# EAGLE design Main-v4.1 (EAGLE 9.1.0)
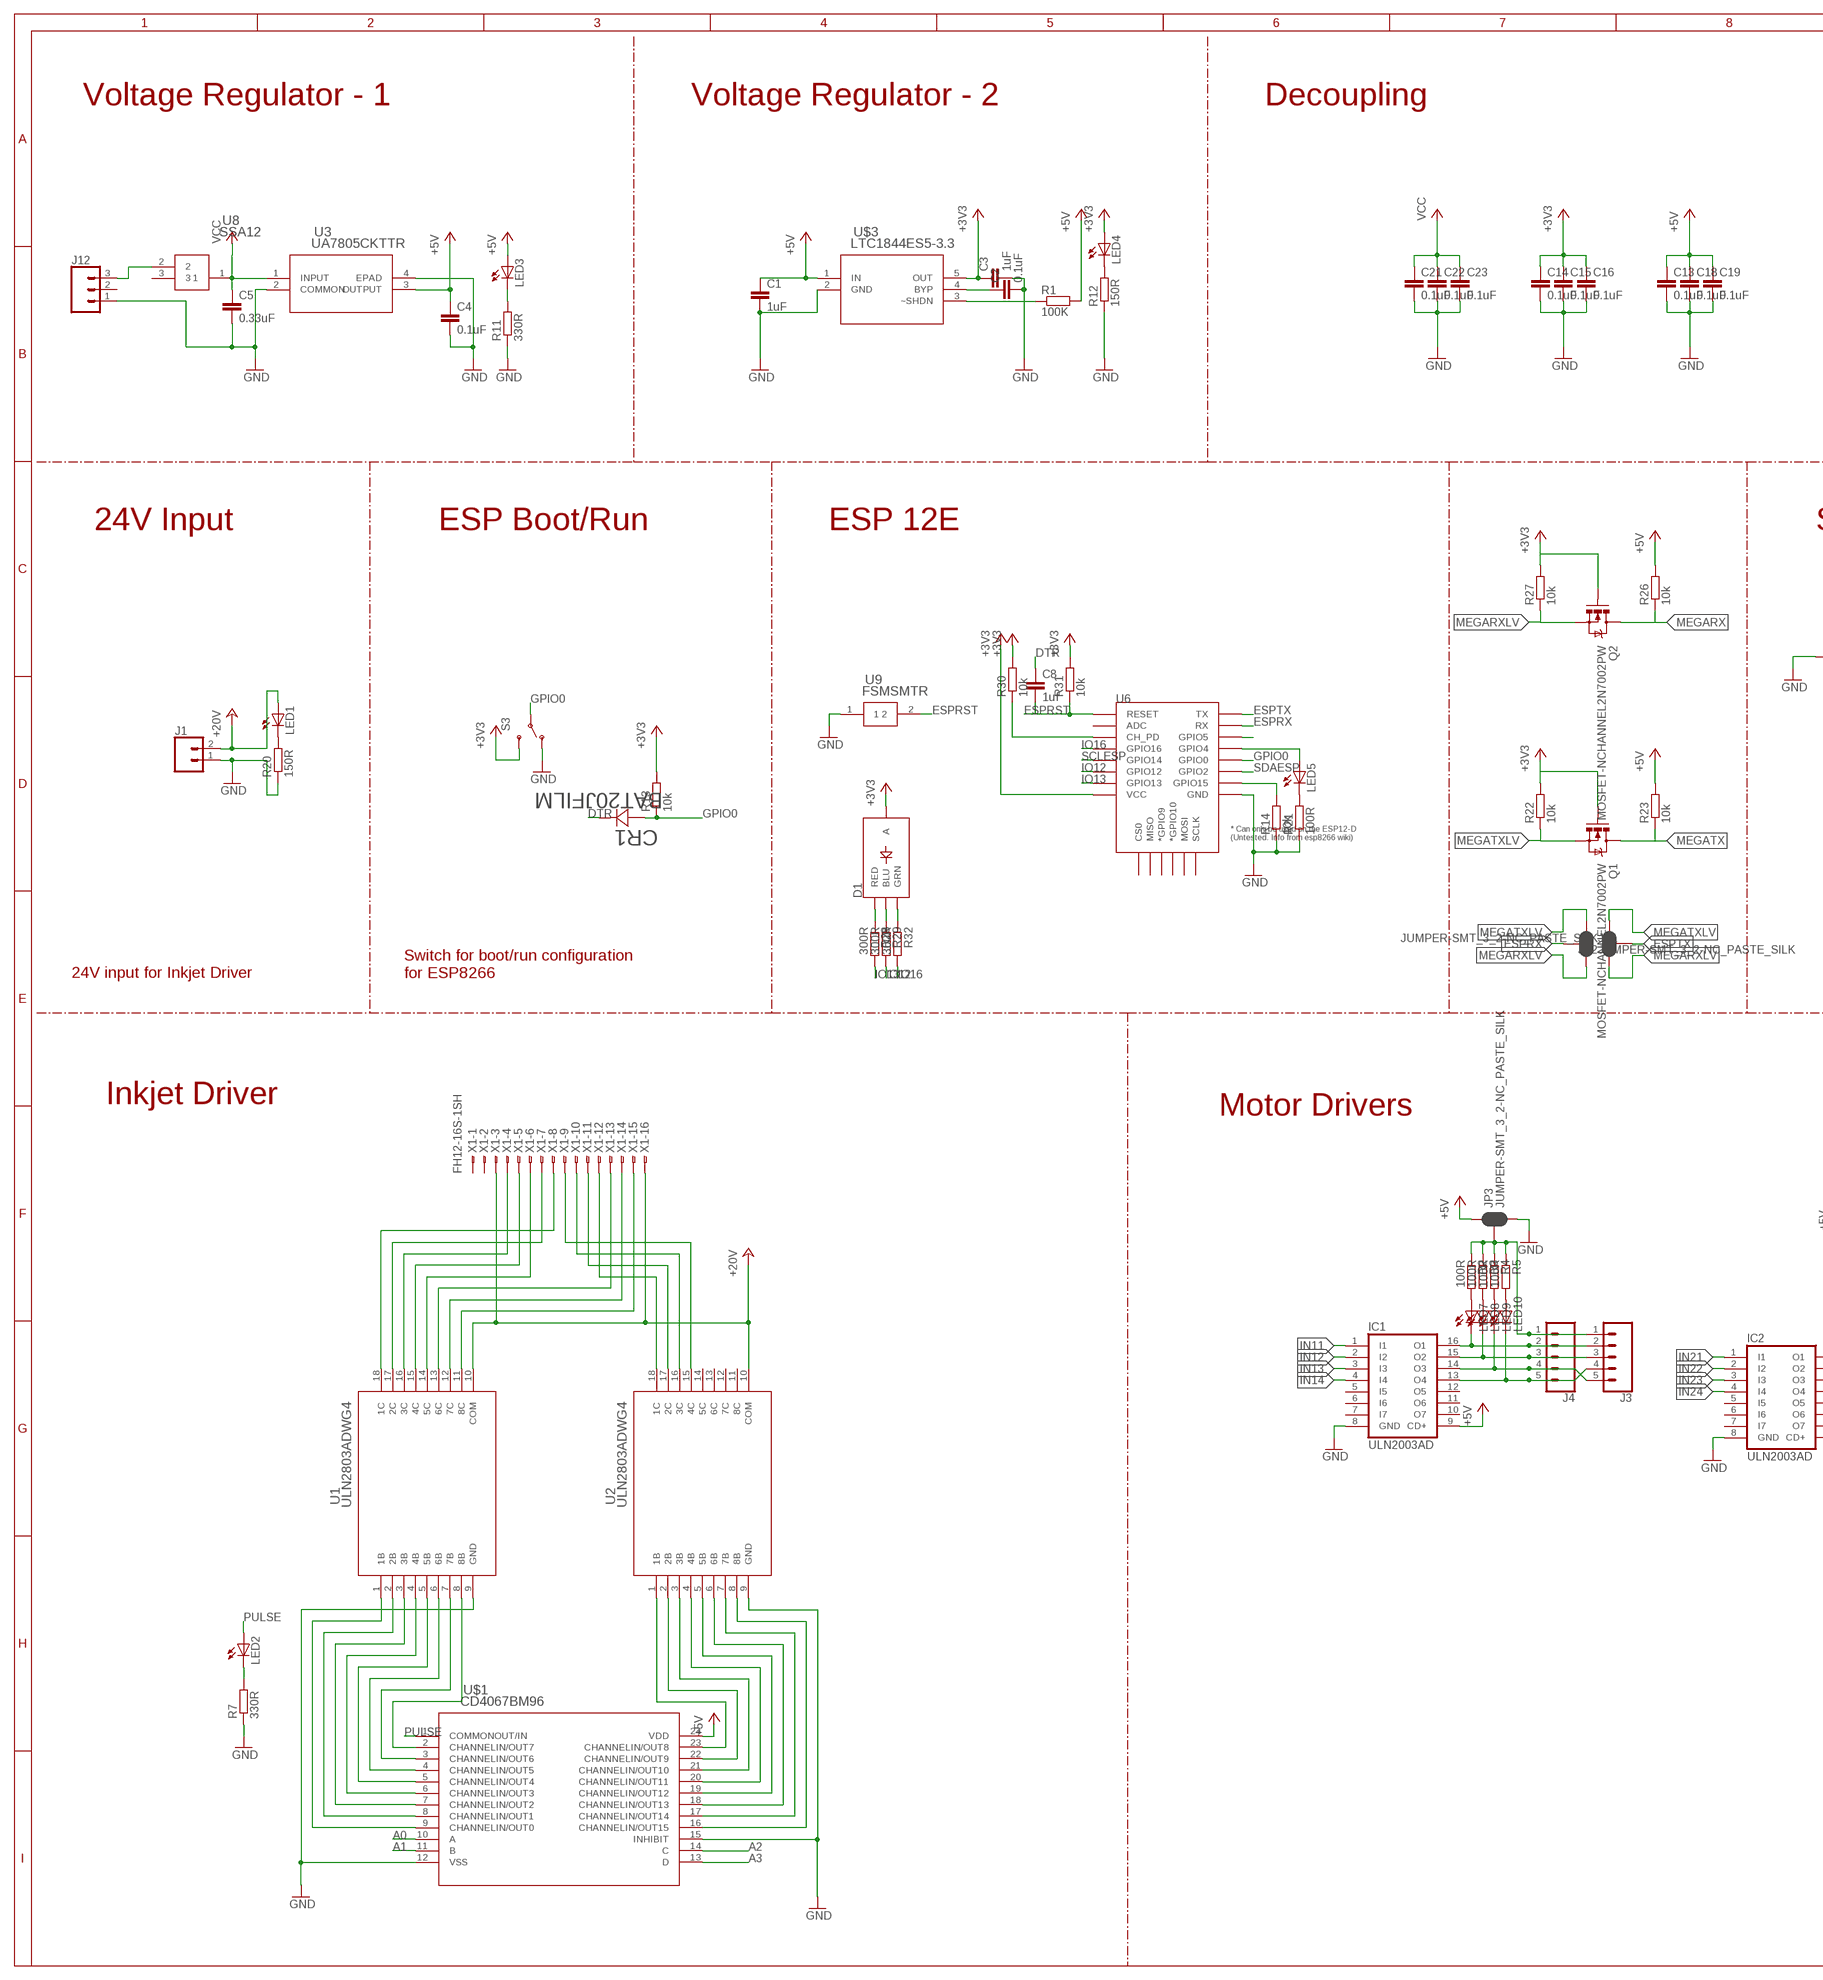
[diagram p0: schematic, sheet 1, part 1 of 3]
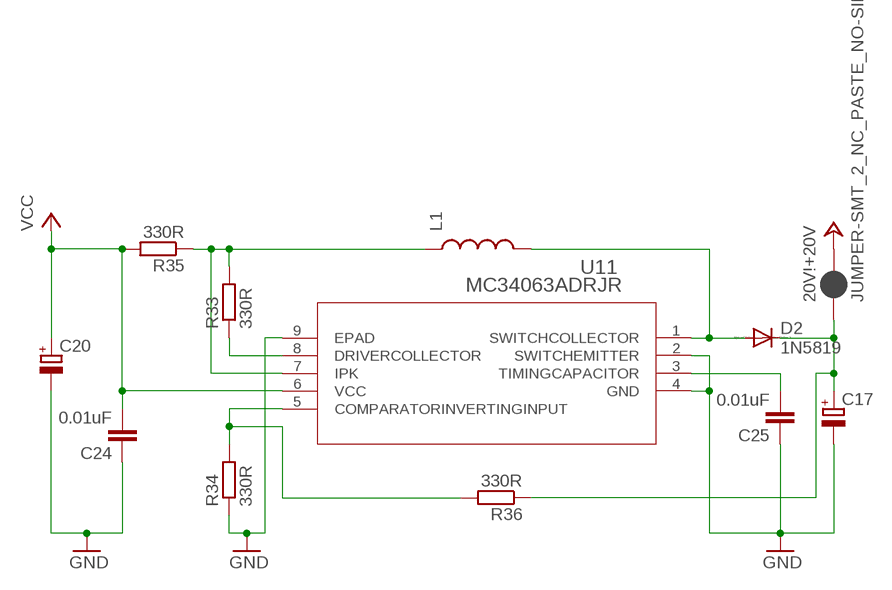
[diagram p1: schematic, sheet 1, part 2 of 3]
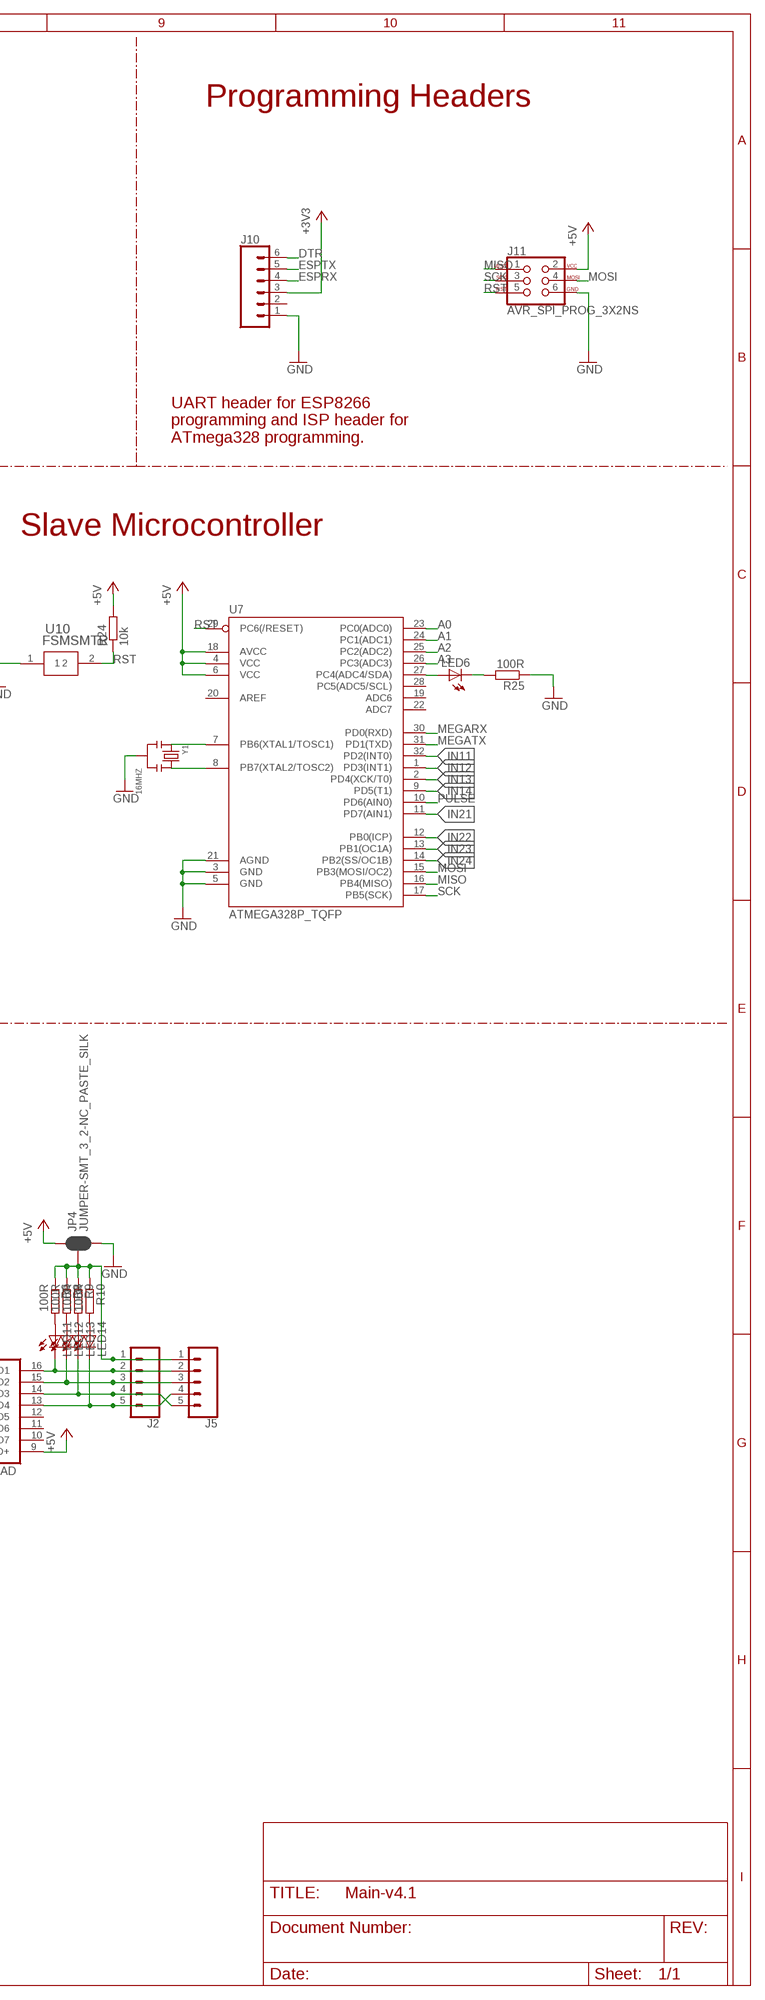
[diagram p2: schematic, sheet 1, part 3 of 3]

## Parts
20V!  JUMPER-SMT_2_NC_PASTE_NO-SILK  [SMT-JUMPER_2_NC_PASTE_NO-SILK]
C1  1uF  C-EUC0603  [C0603]
C2  0.1uF  C-EUC0603  [C0603]
C3  1uF  C-EUC0603  [C0603]
C4  0.1uF  C-EUC0603  [C0603]
C5  0.33uF  C-EUC0603  [C0603]
C8  1uf  C-EUC0603  [C0603]
C13  0.1uF  C-EUC0603  [C0603]
C14  0.1uF  C-EUC0603  [C0603]
C15  0.1uF  C-EUC0603  [C0603]
C16  0.1uF  C-EUC0603  [C0603]
C17  CPOL-EU153CLV-1010  [153CLV-1010]
C18  0.1uF  C-EUC0603  [C0603]
C19  0.1uF  C-EUC0603  [C0603]
C20  CPOL-EUSMCC  [SMC_C]
C21  0.1uF  C-EUC0603  [C0603]
C22  0.1uF  C-EUC0603  [C0603]
C23  0.1uF  C-EUC0603  [C0603]
C24  0.01uF  C-EUC0603K  [C0603K]
C25  0.01uF  C-EUC0603K  [C0603K]
CR1  BAT20JFILM  [SOD-323]
D1  LED-RGB-CASMD  [LED-TRICOLOR-SMD]
D2  1N5819  [SOD123]
IC1  ULN2003AD  [SO16]
IC2  ULN2003AD  [SO16]
J1  CONN_02  [1X02]
J2  CONN_05  [1X05]
J3  CONN_05  [1X05]
J4  CONN_05  [1X05]
J5  CONN_05  [1X05]
J10  CONN_06NO_SILK_NO_POP  [1X06_NO_SILK]
J11  AVR_SPI_PROG_3X2NS  [2X3-NS]
J12  CONN_03  [1X03]
JP1  JUMPER-SMT_3_2-NC_PASTE_SILK  [SMT-JUMPER_3_2-NC_PASTE_SILK]
JP2  JUMPER-SMT_3_2-NC_PASTE_SILK  [SMT-JUMPER_3_2-NC_PASTE_SILK]
JP3  JUMPER-SMT_3_2-NC_PASTE_SILK  [SMT-JUMPER_3_2-NC_PASTE_SILK]
JP4  JUMPER-SMT_3_2-NC_PASTE_SILK  [SMT-JUMPER_3_2-NC_PASTE_SILK]
L1  INDUCTORCR54  [CR54]
LED1  LEDSML0603  [SML0603]
LED2  LEDSML0603  [SML0603]
LED3  LEDSML0603  [SML0603]
LED4  LEDSML0603  [SML0603]
LED5  LEDSML0603  [SML0603]
LED6  LEDSML0603  [SML0603]
LED7  LEDSML0603  [SML0603]
LED8  LEDSML0603  [SML0603]
LED9  LEDSML0603  [SML0603]
LED10  LEDSML0603  [SML0603]
LED11  LEDSML0603  [SML0603]
LED12  LEDSML0603  [SML0603]
LED13  LEDSML0603  [SML0603]
LED14  LEDSML0603  [SML0603]
Q1  MOSFET-NCHANNEL2N7002PW  [SOT323]
Q2  MOSFET-NCHANNEL2N7002PW  [SOT323]
R1  100K  R-EU_R0603  [R0603]
R2  100R  R-EU_R0603  [R0603]
R3  100R  R-EU_R0603  [R0603]
R4  100R  R-EU_R0603  [R0603]
R5  100R  R-EU_R0603  [R0603]
R6  100R  R-EU_R0603  [R0603]
R7  330R  R-EU_R0603  [R0603]
R8  100R  R-EU_R0603  [R0603]
R9  100R  R-EU_R0603  [R0603]
R10  100R  R-EU_R0603  [R0603]
R11  330R  R-EU_R0603  [R0603]
R12  150R  R-EU_R0603  [R0603]
R13  10k  R-EU_R0603  [R0603]
R14  10k  R-EU_R0603  [R0603]
R20  150R  R-EU_R0603  [R0603]
R21  100R  R-EU_R0603  [R0603]
R22  10k  R-EU_R0603  [R0603]
R23  10k  R-EU_R0603  [R0603]
R24  10k  R-EU_R0603  [R0603]
R25  100R  R-EU_R0603  [R0603]
R26  10k  R-EU_R0603  [R0603]
R27  10k  R-EU_R0603  [R0603]
R28  300R  R-EU_R0603  [R0603]
R29  300R  R-EU_R0603  [R0603]
R30  10k  R-EU_R0603  [R0603]
R31  10k  R-EU_R0603  [R0603]
R32  300R  R-EU_R0603  [R0603]
R33  330R  R-EU_R0603  [R0603]
R34  330R  R-EU_R0603  [R0603]
R35  330R  R-EU_R0603  [R0603]
R36  330R  R-EU_R0603  [R0603]
S3  SWITCH-SPDT-SMD-A  [SWITCH-SPST-SMD-A]
U1  ULN2803ADWG4  [DW18]
U2  ULN2803ADWG4  [DW18]
U3  UA7805CKTTR  [KTT3_6P22X6P6]
U6  ESP12ESMD  [ESP12E-SMD]
U7  ATMEGA328P_TQFP  [TQFP32-08]
U8  SSA12  [SWSIP3-P98]
U9  FSMSMTR  [SWITCH_FSMSMTR]
U10  FSMSMTR  [SWITCH_FSMSMTR]
U11  MC34063ADRJR  [DRJ8_2P2X3]
U$1  CD4067BM96  [DW24]
U$3  LTC1844ES5-3.3  [TSOT-23_S5]
X1  FH12-16S-1SH  [FH12-16S-1SH]
Y1  16MHZ  SMD-RESONATOR-16MHZ-15PF-0.5%-40R(3P-3.2X1.3MM)  [X3-SMD-3.6X1.3X0.8MM]

## Nets
+3V3: C3.1 C14.1 C15.1 C16.1 D1.A J10.3 LED4.A Q1.1(G) Q2.1(G) R13.2 R22.2 R27.2 R30.2 R31.2 S3.3(S) U6.VCC U$3.5(OUT)
+5V: C1.1 C4.1 C13.1 C18.1 C19.1 IC1.9(CD+) IC2.9(CD+) J11.2 JP3.1 JP4.1 LED3.A R1.2 R23.2 R24.2 R26.2 U3.3(OUTPUT) U7.4(VCC) U7.6(VCC) U7.18(AVCC) U$1.24(VDD) U$3.1(IN)
+24V: 20V!.2 J1.2 LED1.A U1.10(COM) U2.10(COM) X1.3 X1.16 ; supply symbol labelled +20V
A0: U7.23(PC0(ADC0)) U$1.10(A)
A1: U7.24(PC1(ADC1)) U$1.11(B)
A2: U7.25(PC2(ADC2)) U$1.14(C)
A3: U7.26(PC3(ADC3)) U$1.13(D)
DTR: C8.1 CR1.1 J10.6
ESPRST: C8.2 R31.1 U6.RESET U9.2
ESPRX: J10.4 JP1.2 U6.RXD0(RX)
ESPTX: J10.5 JP2.2 U6.TXD0(TX)
GND: C1.2 C2.2 C3.2 C4.2 C5.2 C13.2 C14.2 C15.2 C16.2 C17.- C18.2 C19.2 C20.- C21.2 C22.2 C23.2 C24.1 C25.1 IC1.8(GND) IC2.8(GND) J1.1 J10.1 J11.6 J12.1 JP3.3 JP4.3 R7.1 R11.1 R12.1 R14.1 R20.1 R21.1 R25.1 R34.1 S3.1(O) U1.9(GND) U2.9(GND) U3.2(COMMON) U3.4(EPAD) U6.GND U7.3(GND) U7.5(GND) U7.21(AGND) U9.1 U10.1 U11.2(SWITCHEMITTER) U11.4(GND) U11.9(EPAD) U$1.12(VSS) U$1.15(INHIBIT) U$3.2(GND) Y1.2
GPIO0: CR1.2 R13.1 S3.2(P) U6.GPIO0
IN11: IC1.1(I1) U7.32(PD2(INT0))
IN12: IC1.2(I2) U7.1(PD3(INT1))
IN13: IC1.3(I3) U7.2(PD4(XCK/T0))
IN14: IC1.4(I4) U7.9(PD5(T1))
IN21: IC2.1(I1) U7.11(PD7(AIN1))
IN22: IC2.2(I2) U7.12(PB0(ICP))
IN23: IC2.3(I3) U7.13(PB1(OC1A))
IN24: IC2.4(I4) U7.14(PB2(SS/OC1B))
IO12: R29.2 U6.GPIO12
IO13: R28.2 U6.GPIO13
IO16: R32.2 U6.GPIO16
MEGARX: Q2.3(D) R26.1 U7.30(PD0(RXD))
MEGARXLV: JP1.3 JP2.1 Q2.2(S) R27.1
MEGATX: Q1.3(D) R23.1 U7.31(PD1(TXD))
MEGATXLV: JP1.1 JP2.3 Q1.2(S) R22.1
MISO: J11.1 U7.16(PB4(MISO))
MOSI: J11.4 U7.15(PB3(MOSI/OC2))
N$1: J12.3 U8.2
N$2: LED7.A R2.2
N$3: U1.8(8B) U$1.2(CHANNELIN/OUT7)
N$4: U1.7(7B) U$1.3(CHANNELIN/OUT6)
N$5: U1.6(6B) U$1.4(CHANNELIN/OUT5)
N$6: U1.5(5B) U$1.5(CHANNELIN/OUT4)
N$7: U1.4(4B) U$1.6(CHANNELIN/OUT3)
N$8: U1.3(3B) U$1.7(CHANNELIN/OUT2)
N$9: U1.2(2B) U$1.8(CHANNELIN/OUT1)
N$10: U1.1(1B) U$1.9(CHANNELIN/OUT0)
N$11: U2.1(1B) U$1.23(CHANNELIN/OUT8)
N$12: U2.2(2B) U$1.22(CHANNELIN/OUT9)
N$13: U2.3(3B) U$1.21(CHANNELIN/OUT10)
N$14: U2.4(4B) U$1.20(CHANNELIN/OUT11)
N$15: U2.5(5B) U$1.19(CHANNELIN/OUT12)
N$16: U2.6(6B) U$1.18(CHANNELIN/OUT13)
N$17: LED8.A R3.2
N$18: IC1.16(O1) J3.2 J4.2 LED7.C
N$19: IC1.15(O2) J3.3 J4.3 LED8.C
N$20: IC1.14(O3) J3.5 J4.4 LED9.C
N$21: U1.11(8C) X1.15
N$22: U1.12(7C) X1.14
N$23: U1.13(6C) X1.13
N$24: U1.14(5C) X1.6
N$25: U1.15(4C) X1.5
N$26: U1.16(3C) X1.4
N$27: U1.17(2C) X1.7
N$28: U1.18(1C) X1.8
N$29: U2.8(8B) U$1.16(CHANNELIN/OUT15)
N$30: U2.18(1C) X1.12
N$31: U2.17(2C) X1.11
N$32: U2.16(3C) X1.10
N$33: U2.15(4C) X1.9
N$34: U2.7(7B) U$1.17(CHANNELIN/OUT14)
N$35: IC1.13(O4) J3.4 J4.5 LED10.C
N$37: L1.P$1 R33.2 R35.1 U11.7(IPK)
N$38: C2.1 U$3.4(BYP)
N$39: R1.1 U$3.3(~SHDN)
N$43: IC2.16(O1) J2.2 J5.2 LED11.C
N$44: IC2.15(O2) J2.3 J5.3 LED12.C
N$45: LED2.C R7.2
N$46: IC2.14(O3) J2.4 J5.5 LED13.C
N$47: IC2.13(O4) J2.5 J5.4 LED14.C
N$48: LED11.A R6.2
N$49: LED12.A R8.2
N$50: LED3.C R11.2
N$51: LED4.C R12.2
N$52: R30.1 U6.CH_PD
N$53: LED13.A R9.2
N$54: LED14.A R10.2
N$55: LED6.C R25.2
N$56: LED5.C R21.2
N$57: LED9.A R4.2
N$58: U7.8(PB7(XTAL2/TOSC2)) Y1.3
N$59: U7.7(PB6(XTAL1/TOSC1)) Y1.1
N$60: D1.R(RED) R28.1
N$61: D1.B(BLU) R29.1
N$62: D1.G(GRN) R32.1
N$65: LED10.A R5.2
N$66: J2.1 J5.1 JP4.2 R6.1 R8.1 R9.1 R10.1
N$68: J3.1 J4.1 JP3.2 R2.1 R3.1 R4.1 R5.1
N$71: 20V!.1 C17.+ D2.C R36.1
N$72: R34.2 R36.2 U11.5(COMPARATORINVERTINGINPUT)
N$79: LED1.C R20.2
N$80: LED5.A U6.GPIO4
N$84: R14.2 U6.GPIO15
N$85: R33.1 U11.8(DRIVERCOLLECTOR)
N$86: D2.A L1.P$2 U11.1(SWITCHCOLLECTOR)
N$88: C25.2 U11.3(TIMINGCAPACITOR)
N$91: U6.GPIO5
PULSE: LED2.A U7.10(PD6(AIN0)) U$1.1(COMMONOUT/IN)
RST: J11.5 R24.1 U7.29(PC6(/RESET)) U10.2
SCK: J11.3 U7.17(PB5(SCK))
SCLESP: U6.GPIO14
SDA: LED6.A U7.27(PC4(ADC4/SDA))
SDAESP: U6.GPIO2
VCC: C5.1 C20.+ C21.1 C22.1 C23.1 C24.2 R35.2 U3.1(INPUT) U8.1 U11.6(VCC)
Unconnected: IC1.5(I5) IC1.6(I6) IC1.7(I7) IC1.10(O7) IC1.11(O6) IC1.12(O5) IC2.5(I5) IC2.6(I6) IC2.7(I7) IC2.10(O7) IC2.11(O6) IC2.12(O5) J10.2 J12.2 U2.11(8C) U2.12(7C) U2.13(6C) U2.14(5C) U6.ADC U6.CS0 U6.GPIO9(*GPIO9) U6.GPIO10(*GPIO10) U6.MISO U6.MOSI U6.SCLK U7.19(ADC6) U7.20(AREF) U7.22(ADC7) U7.28(PC5(ADC5/SCL)) U8.3 X1.1 X1.2

## Notes on the sheet
- Voltage Regulator - 1 | Voltage Regulator - 2 | Decoupling | Programming Headers
- UART header for ESP8266
  programming and ISP header for
  ATmega328 programming.
- 24V Input | ESP Boot/Run | ESP 12E | Slave Microcontroller
- 24V input for Inkjet Driver
- Switch for boot/run configuration
  for ESP8266
- Inkjet Driver
- Motor Drivers

## Library data of the parts
20V! = SparkFun-Jumpers:JUMPER-SMT_2_NC_PASTE: Normally closed solder jumper This jumper has an aperture in the stencil to allow solder paste to bridge the split in the wire so it's normally closed (NC). Wick off the solder to open the connection. Reapply solder to reclose the connection.
C1-C5 C8 C13-C16 C18 C19 C21-C25 = resistor:C-EU: CAPACITOR, European symbol
C17 C20 = resistor:CPOL-EU: POLARIZED CAPACITOR, European symbol
CR1 = Beeclust:BAT20JFILM; MANUFACTURER_PART_NUMBER: BAT20JFILM; VENDOR: ST Microelectronics
D1 = SparkFun-LED:LED-RGB-CA: LED-RGB Diffused Common Anode Packages: LED RGB-THRU P-LCC-4-3 LED-TRICOLOR-SMD SparkFun Products: RGB Diffused Common Anode- Diffuse <[https://www.sparkfun.com/products/10821]> RGB Diffused Common Anode - Clear <[https://www.sparkfun.com/products/10820]> Qduino Mini <[https://www.sparkfun.com/products/13614]> Triple Output LED RGB - SMD <https://www.sparkfun.com/products/7844>; PROD_ID: DIO-08324
D2 = Beeclust:1N5819: SCHOTTKY BARRIER RECTIFIER Source: http://onsemi.com .. MBR0520LT1-D.pdf
IC1 IC2 = uln-udn:ULN2003A: DRIVER ARRAY
J1 = SparkFun-Connectors:CONN_02: Multi connection point. Often used as Generic Header-pin footprint for 0.1 inch spaced/style header connections On any of the 0.1 inch spaced packages, you can populate with these: Break Away Headers - Straight <https://www.sparkfun.com/products/116> (PRT-00116) Break Away Male Headers - Right Angle <https://www.sparkfun.com/products/553> (PRT-00553) Female Headers <https://www.sparkfun.com/products/115> (PRT-00115) Break Away Headers - Machine Pin <https://www.sparkfun.com/products/117> (PRT-00117) Break Away Female Headers - Swiss Machine Pin <https://www.sparkfun.com/products/743> (PRT-00743) For SCREWTERMINALS and SPRING TERMINALS visit here: Screw Terimnals on SparkFun.com <https://www.sparkfun.com/search/results?term=Screw+Terminals> (5mm/3.5mm/2.54mm spacing) This device is also useful as a general connection point to wire up your design to another part of your project. Our various solder wires solder well into these plated through hole pads. Hook-Up Wire - Assortment (Stranded, 22 AWG) <https://www.sparkfun.com/products/11375> (PRT-11375) Hook-Up Wire - Assortment (Solid Core, 22 AWG) <https://www.sparkfun.com/products/11367> (PRT-11367) View the entire wire category on our website here <https://www.sparkfun.com/categories/141> Special notes: Molex polarized connector foot print use with: PRT-08233 with associated crimp pins and housings. 2.54_SCREWTERM for use with PRT-10571. 3.5mm Screw Terminal footprints for PRT-08084 5mm Screw Terminal footprints for use with PRT-08432
J2-J5 = SparkFun-Connectors:CONN_05: Multi connection point. Often used as Generic Header-pin footprint for 0.1 inch spaced/style header connections On any of the 0.1 inch spaced packages, you can populate with these: Break Away Headers - Straight <https://www.sparkfun.com/products/116> (PRT-00116) Break Away Male Headers - Right Angle <https://www.sparkfun.com/products/553> (PRT-00553) Female Headers <https://www.sparkfun.com/products/115> (PRT-00115) Break Away Headers - Machine Pin <https://www.sparkfun.com/products/117> (PRT-00117) Break Away Female Headers - Swiss Machine Pin <https://www.sparkfun.com/products/743> (PRT-00743) For SCREWTERMINALS and SPRING TERMINALS visit here: Screw Terimnals on SparkFun.com <https://www.sparkfun.com/search/results?term=Screw+Terminals> (5mm/3.5mm/2.54mm spacing) This device is also useful as a general connection point to wire up your design to another part of your project. Our various solder wires solder well into these plated through hole pads. Hook-Up Wire - Assortment (Stranded, 22 AWG) <https://www.sparkfun.com/products/11375> (PRT-11375) Hook-Up Wire - Assortment (Solid Core, 22 AWG) <https://www.sparkfun.com/products/11367> (PRT-11367) View the entire wire category on our website here <https://www.sparkfun.com/categories/141> Special notes: Molex polarized connector foot print use with SKU : PRT-08231 with associated crimp pins and housings. 1MM SMD Version SKU: PRT-10208
J10 = SparkFun-Connectors:CONN_06: Multi connection point. Often used as Generic Header-pin footprint for 0.1 inch spaced/style header connections On any of the 0.1 inch spaced packages, you can populate with these: Break Away Headers - Straight <https://www.sparkfun.com/products/116> (PRT-00116) Break Away Male Headers - Right Angle <https://www.sparkfun.com/products/553> (PRT-00553) Female Headers <https://www.sparkfun.com/products/115> (PRT-00115) Break Away Headers - Machine Pin <https://www.sparkfun.com/products/117> (PRT-00117) Break Away Female Headers - Swiss Machine Pin <https://www.sparkfun.com/products/743> (PRT-00743) Arduino Stackable Header - 6 Pin <https://www.sparkfun.com/products/9280> (PRT-09280) For SCREWTERMINALS and SPRING TERMINALS visit here: Screw Terimnals on SparkFun.com <https://www.sparkfun.com/search/results?term=Screw+Terminals> (5mm/3.5mm/2.54mm spacing) This device is also useful as a general connection point to wire up your design to another part of your project. Our various solder wires solder well into these plated through hole pads. Hook-Up Wire - Assortment (Stranded, 22 AWG) <https://www.sparkfun.com/products/11375> (PRT-11375) Hook-Up Wire - Assortment (Solid Core, 22 AWG) <https://www.sparkfun.com/products/11367> (PRT-11367) View the entire wire category on our website here <https://www.sparkfun.com/categories/141>
J11 = SparkFun-Connectors:AVR_SPI_PROG_3X2: AVR ISP 6 Pin This is the reduced ISP connector for AVR programming. Common on Arduino. This footprint will take up less PCB space and can be used with a 10-pin to 6-pin adapter such as SKU: BOB-08508 **Special note about "TEST_POINT" package. The stop mask is on the top side, so if you want your programming test points to be on the bottom of your board, make sure to place this package on the bottom side of the board. This also ensure that the orientation to program from the bottom side will be correct. SparkFun Products: SparkFun ISP Pogo Adapter <https://www.sparkfun.com/products/11591> - NS Tiny AVR Programmer <https://www.sparkfun.com/products/11801> -PTH
J12 = SparkFun-Connectors:CONN_03: Multi connection point. Often used as Generic Header-pin footprint for 0.1 inch spaced/style header connections On any of the 0.1 inch spaced packages, you can populate with these: Break Away Headers - Straight <https://www.sparkfun.com/products/116> (PRT-00116) Break Away Male Headers - Right Angle <https://www.sparkfun.com/products/553> (PRT-00553) Female Headers <https://www.sparkfun.com/products/115> (PRT-00115) Break Away Headers - Machine Pin <https://www.sparkfun.com/products/117> (PRT-00117) Break Away Female Headers - Swiss Machine Pin <https://www.sparkfun.com/products/743> (PRT-00743) Stackable Header - 3 Pin (Female, 0.1") <https://www.sparkfun.com/products/13875> (PRT-13875) For SCREWTERMINALS and SPRING TERMINALS visit here: Screw Terimnals on SparkFun.com <https://www.sparkfun.com/search/results?term=Screw+Terminals> (5mm/3.5mm/2.54mm spacing) This device is also useful as a general connection point to wire up your design to another part of your project. Our various solder wires solder well into these plated through hole pads. Hook-Up Wire - Assortment (Stranded, 22 AWG) <https://www.sparkfun.com/products/11375> (PRT-11375) Hook-Up Wire - Assortment (Solid Core, 22 AWG) <https://www.sparkfun.com/products/11367> (PRT-11367) View the entire wire category on our website here <https://www.sparkfun.com/categories/141> Special notes: Molex polarized connector foot print use with SKU : PRT-08232 with associated crimp pins and housings.
JP1-JP4 = SparkFun-Jumpers:JUMPER-SMT_3_2-NC_PASTE: Normally closed solder jumper (2 of 2 connections) This jumper has an aperture in the stencil to allow solder paste to bridge both connections. Both connections are normally closed (NC). Wick off the solder to open the connection(s). Reapply solder to reclose the connection(s).
L1 = adjacent-reality:INDUCTOR: Inductors Basic Inductor/Choke - 0603 and 1206. Footprints are not proven and vary greatly between part numbers. CC-BY-SA from SparkFun
LED1-LED14 = led:LED: LED OSRAM: - CHIPLED LG R971, LG N971, LY N971, LG Q971, LY Q971, LO R971, LY R971 LH N974, LH R974 LS Q976, LO Q976, LY Q976 LO Q996 - Hyper CHIPLED LW Q18S LB Q993, LB Q99A, LB R99A - SideLED LS A670, LO A670, LY A670, LG A670, LP A670 LB A673, LV A673, LT A673, LW A673 LH A674 LY A675 LS A676, LA A676, LO A676, LY A676, LW A676 LS A679, LY A679, LG A679 - Hyper Micro SIDELED® LS Y876, LA Y876, LO Y876, LY Y876 LT Y87S - SmartLED LW L88C, LW L88S LB L89C, LB L89S, LG L890 LS L89K, LO L89K, LY L89K LS L896, LA L896, LO L896, LY L896 - TOPLED LS T670, LO T670, LY T670, LG T670, LP T670 LSG T670, LSP T670, LSY T670, LOP T670, LYG T670 LG T671, LOG T671, LSG T671 LB T673, LV T673, LT T673, LW T673 LH T674 LS T676, LA T676, LO T676, LY T676, LB T676, LH T676, LSB T676, LW T676 LB T67C, LV T67C, LT T67C, LS T67K, LO T67K, LY T67K, LW E67C LS E67B, LA E67B, LO E67B, LY E67B, LB E67C, LV E67C, LT E67C LW T67C LS T679, LY T679, LG T679 LS T770, LO T770, LY T770, LG T770, LP T770 LB T773, LV T773, LT T773, LW T773 LH T774 LS E675, LA E675, LY E675, LS T675 LS T776, LA T776, LO T776, LY T776, LB T776 LHGB T686 LT T68C, LB T68C - Hyper Mini TOPLED® LB M676 - Mini TOPLED Santana® LG M470 LS M47K, LO M47K, LY M47K Source: http://www.osram.convergy.de LUXEON: - LUMILED® LXK2-PW12-R00, LXK2-PW12-S00, LXK2-PW14-U00, LXK2-PW14-V00 LXK2-PM12-R00, LXK2-PM12-S00, LXK2-PM14-U00 LXK2-PE12-Q00, LXK2-PE12-R00, LXK2-PE12-S00, LXK2-PE14-T00, LXK2-PE14-U00 LXK2-PB12-K00, LXK2-PB12-L00, LXK2-PB12-M00, LXK2-PB14-N00, LXK2-PB14-P00, LXK2-PB14-Q00 LXK2-PR12-L00, LXK2-PR12-M00, LXK2-PR14-Q00, LXK2-PR14-R00 LXK2-PD12-Q00, LXK2-PD12-R00, LXK2-PD12-S00 LXK2-PH12-R00, LXK2-PH12-S00 LXK2-PL12-P00, LXK2-PL12-Q00, LXK2-PL12-R00 Source: www.luxeon.com KINGBRIGHT: KA-3528ASYC Source: www.kingbright.com
Q1 Q2 = SparkFun-DiscreteSemi:MOSFET-NCHANNEL: Common NMOSFET Parts MFG P/N Store ID Prod ID FDD8780 TRANS-09984 SI7820DN TRANS-11055 FDS6630A IC-08089 2N7002PW TRANS-11151 FQP30N06L COM-10213 TRANS-10060 BSS123LT1G TRANS-08345 BSS138 TRANS-00830 BS170 2N7000; PROD_ID: TRANS-11151
R1-R14 R20-R36 = resistor:R-EU_: RESISTOR, European symbol
S3 = SparkFun-Electromechanical:SWITCH-SPDT: SPDT Switch Simple slide switch, Spark Fun Electronics SKU : COM-00102 DPDT SMT slide switch, AYZ0202, SWCH-08179; PROD_ID: SWCH-10651
U1 U2 = Beeclust:ULN2803ADWG4; MANUFACTURER_PART_NUMBER: ULN2803ADWG4; VENDOR: Texas Instruments
U3 = Beeclust:UA7805CKTTR; MANUFACTURER_PART_NUMBER: UA7805CKTTR; VENDOR: Texas Instruments
U6 = esp8266modules:ESP12E: ESP12E Module
U7 = SparkFun-IC-Microcontroller:ATMEGA328P_TQFP: Popular 328P in QFP Storefront component: ATmega328 - TQFP <https://www.sparkfun.com/products/13448> (COM-13448) Datasheet <http://www.sparkfun.com/datasheets/Components/SMD/ATMega328.pdf> SparkFun Products SparkFun RedBoard - Programmed with Arduino <https://www.sparkfun.com/products/12757> (DEV-12757) Arduino Pro Mini 328 - 5V/16MHz <https://www.sparkfun.com/products/11113> (DEV-11113) Arduino Pro Mini 328 - 3.3V/8MHz <https://www.sparkfun.com/products/11114> (DEV-11114) SparkFun OpenLog <https://www.sparkfun.com/products/13712> (DEV-13712) SparkFun MicroView - OLED Arduino Module <https://www.sparkfun.com/products/12923> (DEV-12923) SparkFun Digital Sandbox <https://www.sparkfun.com/products/12651> (DEV-12651) SparkFun PicoBoard <https://www.sparkfun.com/products/11888> (WIG-11888) Arduino Fio <https://www.sparkfun.com/products/10116> (DEV-10116) LilyPad Arduino 328 Main Board <https://www.sparkfun.com/products/13342> (DEV-13342) SparkFun RedStick <https://www.sparkfun.com/products/13741> (DEV-13741) LilyPad MP3 <https://www.sparkfun.com/products/11013> (DEV-11013) LilyPad Arduino SimpleSnap <https://www.sparkfun.com/products/10941> (DEV-10941) SparkFun Stepoko <https://www.sparkfun.com/products/13899> (ROB-13899) SparkFun Geiger Counter <https://www.sparkfun.com/products/11345> (SEN-11345) SparkFun EL Sequencer <https://www.sparkfun.com/products/12781> (COM-12781) Arduino Pro 328 - 5V/16MHz <https://www.sparkfun.com/products/10915> (DEV-10915) CryptoCape <https://www.sparkfun.com/products/12773> (DEV-12773) SparkFun IR Thermometer Evaluation Board - MLX90614 <https://www.sparkfun.com/products/10740> (SEN-10740) SparkFun RedBot Mainboard <https://www.sparkfun.com/products/12097> (ROB-12097) Arduino Pro 328 - 3.3V/8MHz <https://www.sparkfun.com/products/10914> (DEV-10914) SparkFun Block for Intel® Edison - Arduino <https://www.sparkfun.com/products/13036> (DEV-13036) SparkFun Simon Says - Surface Mount Soldering Kit <https://www.sparkfun.com/products/10935> (KIT-10935) SparkFun 7-Segment Serial Display - Red <https://www.sparkfun.com/products/11441> (COM-11441) SparkFun 7-Segment Serial Display - White <https://www.sparkfun.com/products/11629> (COM-11629) SparkFun 7-Segment Serial Display - Yellow <https://www.sparkfun.com/products/11443> (COM-11443) SparkFun 7-Segment Serial Display - Kelly Green <https://www.sparkfun.com/products/11440> (COM-11440) SparkFun 7-Segment Serial Display - Blue <https://www.sparkfun.com/products/11442> (COM-11442) SparkFun OpenSegment Serial Display - 20mm (Blue) <https://www.sparkfun.com/products/11647> (COM-11647) SparkFun OpenSegment Serial Display - 20mm (Green) <https://www.sparkfun.com/products/11646> (COM-11646) SparkFun OpenSegment Serial Display - 20mm (White) <https://www.sparkfun.com/products/11648> (COM-11648) SparkFun OpenSegment Serial Display - 20mm (Red) <https://www.sparkfun.com/products/11644> (COM-11644) SparkFun OpenSegment Serial Display - 20mm (Yellow) <https://www.sparkfun.com/products/11645> (COM-11645) SparkFun OpenSegment Shield <https://www.sparkfun.com/products/13190> (DEV-13190); PROD_ID: IC-09069
U8 = Beeclust:SSA12; MANUFACTURER_PART_NUMBER: SSA12; VENDOR: TE Connectivity
U9 U10 = Beeclust:FSMSMTR; MANUFACTURER_PART_NUMBER: FSMSMTR; VENDOR: TE Connectivity
U11 = Beeclust:MC34063ADRJR; MANUFACTURER_PART_NUMBER: MC34063ADRJR; VENDOR: Vendor
U$1 = Beeclust:CD4067BM96; MANUFACTURER_PART_NUMBER: CD4067B_DW_24; VENDOR: Texas Instruments
U$3 = Beeclust:LTC1844ES5-3.3
X1 = con-hirose:FH12-16S-1S: 1mm Pitch Connectors For FPC/FFC Source: Data sheet <http://www.hirose.co.jp/cataloge_hp/e58605370.pdf>; OC_FARNELL: unknown; OC_NEWARK: unknown
Y1 = Seeed-Crystal Oscillator:SMD-RESONATOR-16MHZ-15PF-0.5%-40R(3P-3.2X1.3MM): 306030002; MPN: CSTCE16M0V53-R0

## Board
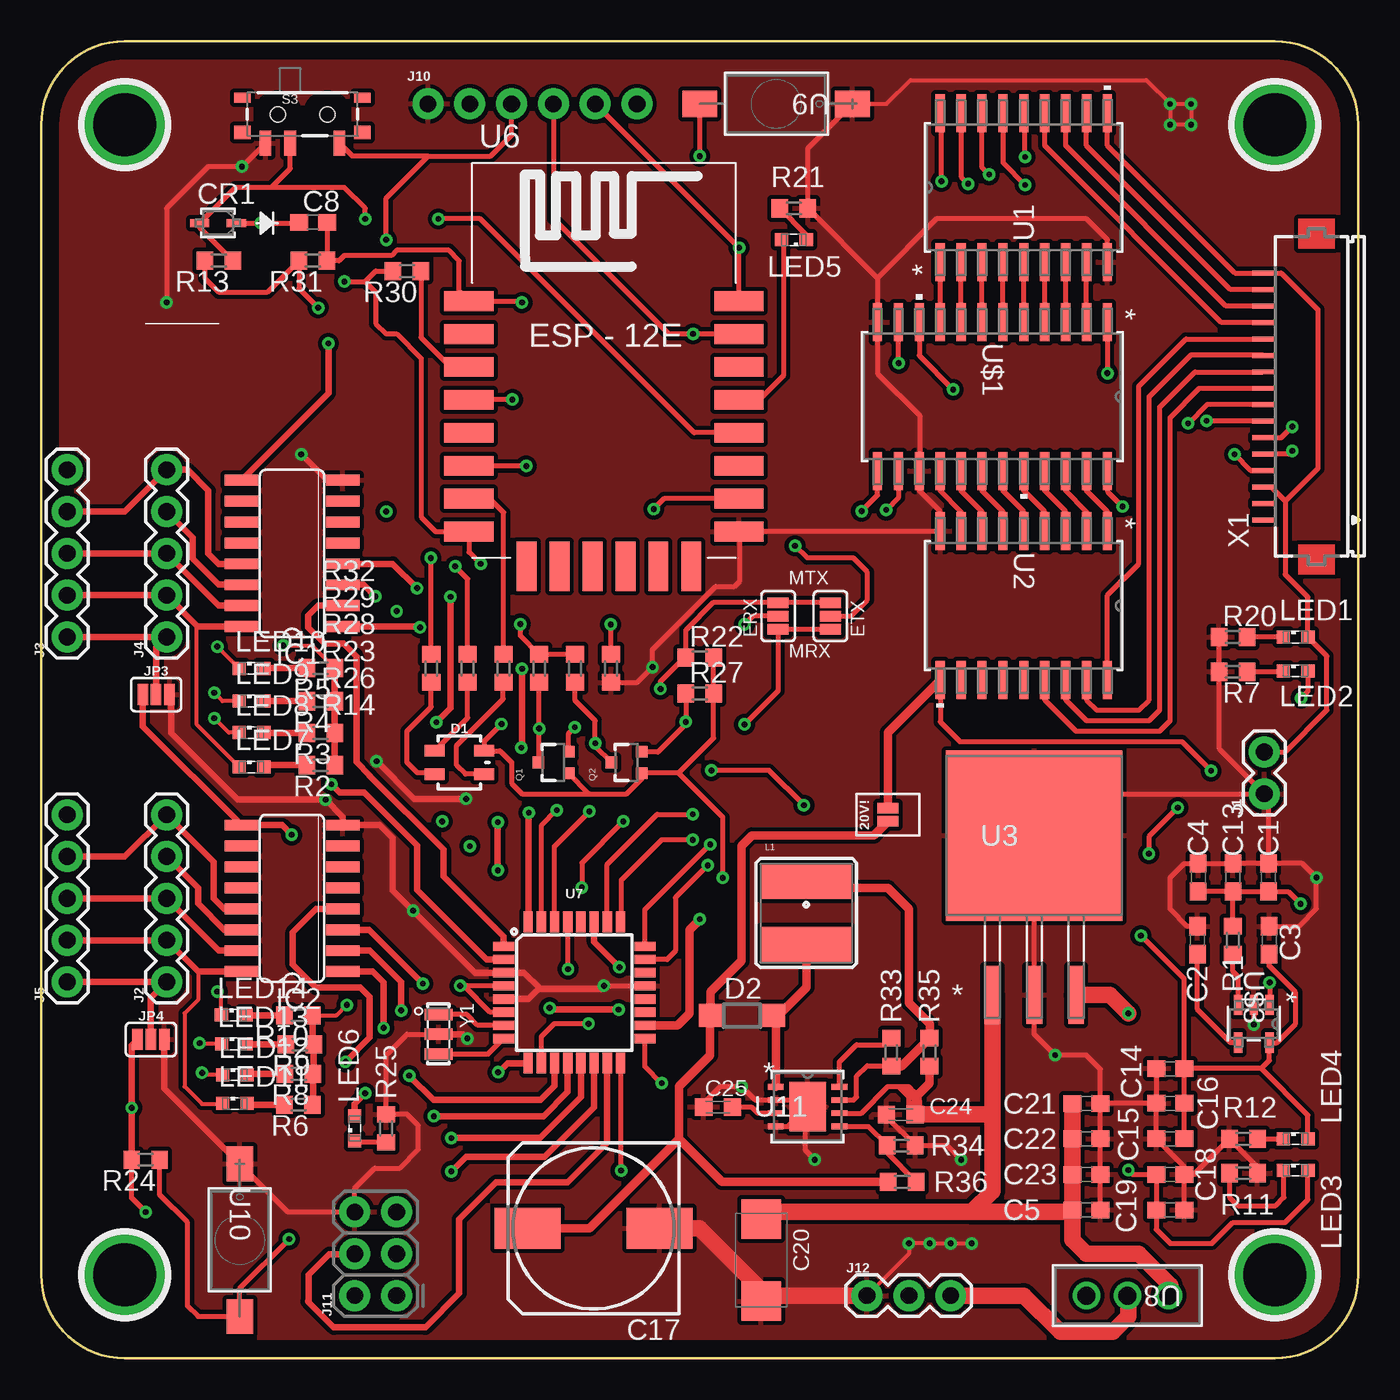
[diagram p3: board, top side]
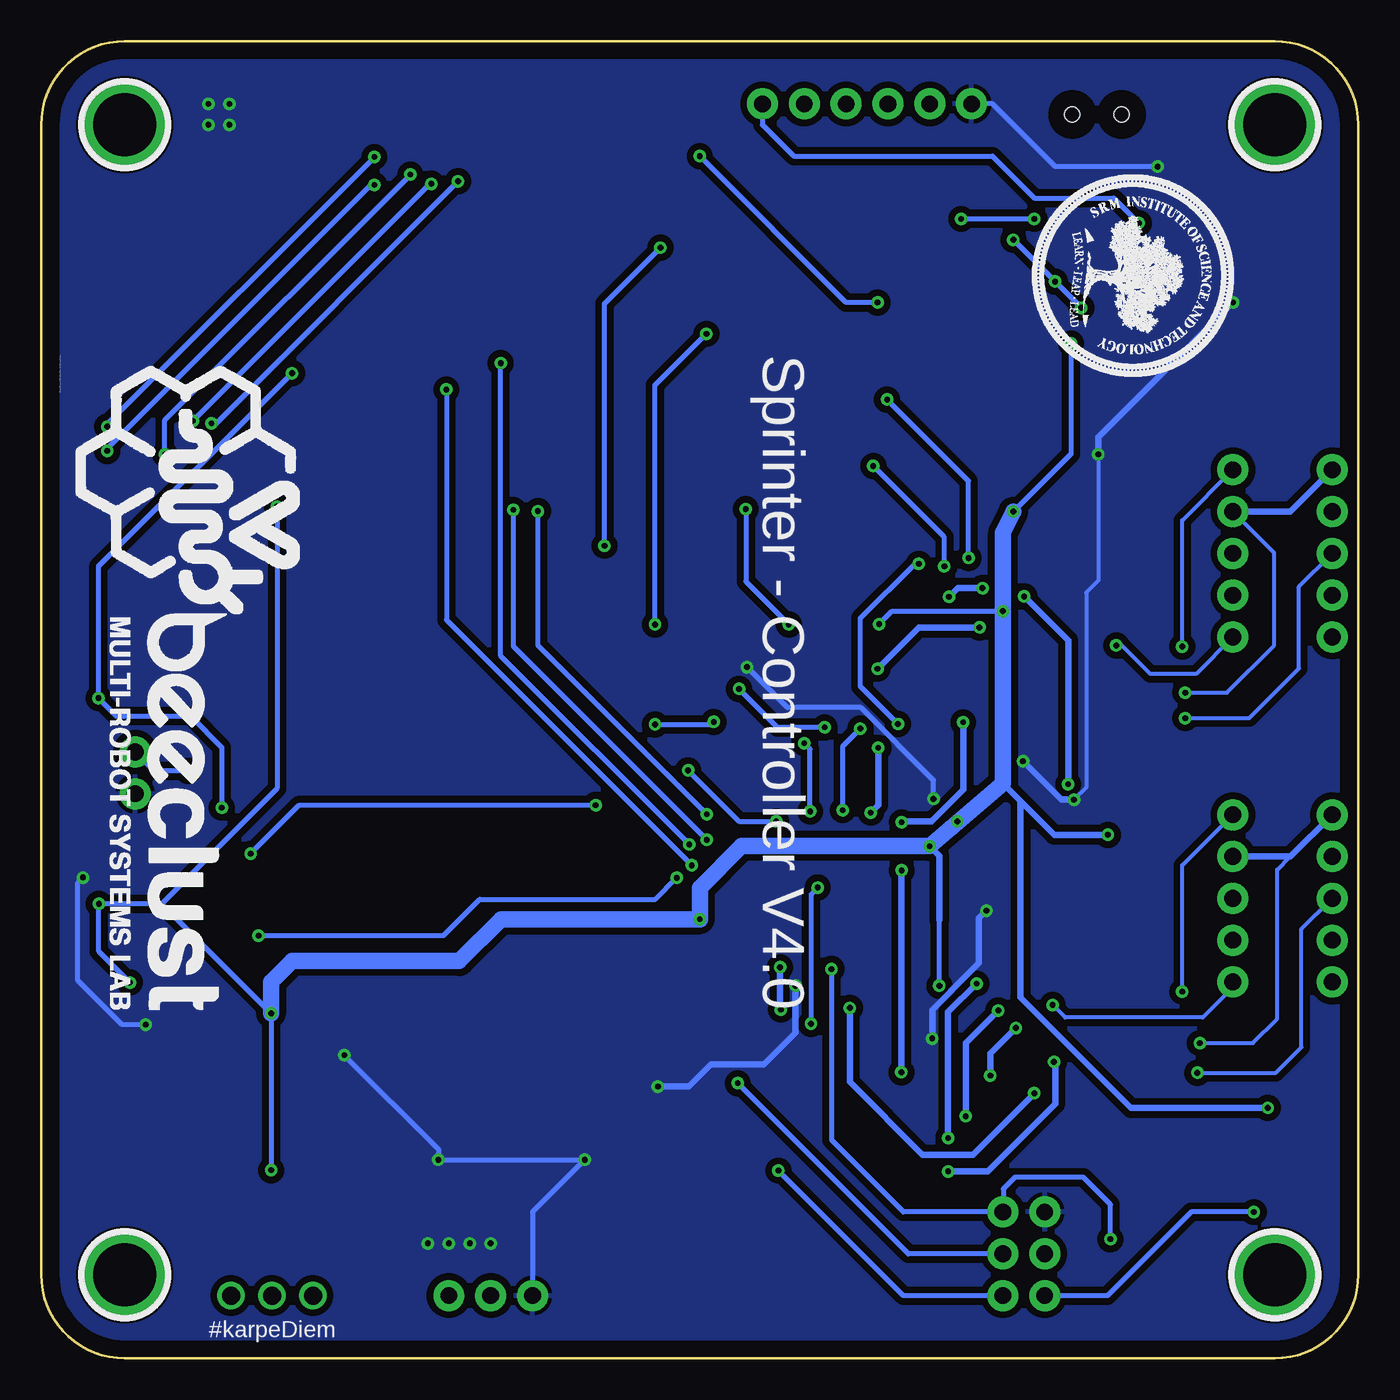
[diagram p4: board, bottom side, seen from below]

Size 80.01 x 80.01 mm. Coordinates in mm from the lower left corner, seen from the top.
Outline: 80.01,5.08 80.01,72.39
Outline: 80.01,5.08 80.01,74.93 arc90 74.93,80.01 5.08,80.01 arc90 0,74.93 0,5.08 arc90 5.08,0 74.93,0 arc90 80.01,5.08
Copper layers (1*16): Top 0.035mm / dielectric 1.5mm / Bottom 0.035mm
Design rules "default *": minimum track width 6mil, minimum drill 0.35mm, track to track 6mil, track to pad 6mil, pad to pad 6mil, via to via 6mil, smd to smd 6mil, copper to edge 40mil, drill to drill 6mil, minimum pad ring 10mil, minimum via ring 8mil, stop-mask expansion 4mil, vias tented up to drill 14mil, thermal gap 10mil

### Footprints (pad centres in the part's own frame; a part is rotated, then mirrored left to right if it is on the bottom)
SMT-JUMPER_2_NC_PASTE_NO-SILK = smd 0.635 x 1.27: 1 -0.406,0; 2 0.406,0
C0603 = smd 1.1 x 1: 1 -0.85,0; 2 0.85,0
153CLV-1010 = smd 4 x 2.5: + 4,0; - -4,0
SMC_C = smd 2.4 x 2.4: + -2.5,0; - 2.5,0
C0603K = smd 1.05 x 1.08: 1 -0.875,0; 2 0.875,0
SOD-323 = smd 1.168 x 0.483: 1 -1.118,0; 2 1.118,0
LED-TRICOLOR-SMD = smd 1.2 x 0.7: A 1.5,0.7; B -1.5,0.7; G -1.5,-0.7; R 1.5,-0.7
SOD123 = smd 1.4 x 1.4: A 1.9,0; C -1.9,0
SO16 = smd 0.66 x 2.032: 1 -4.445,-3.073; 2 -3.175,-3.073; 3 -1.905,-3.073; 4 -0.635,-3.073; 5 0.635,-3.073; 6 1.905,-3.073; 7 3.175,-3.073; 8 4.445,-3.073; 9 4.445,3.073; 10 3.175,3.073; 11 1.905,3.073; 12 0.635,3.073; 13 -0.635,3.073; 14 -1.905,3.073; 15 -3.175,3.073; 16 -4.445,3.073
1X02 = drill 1.016 pad 1.88: 1 0,0; 2 2.54,0
1X05 = drill 1.016 pad 1.88: 1 0,0; 2 2.54,0; 3 5.08,0; 4 7.62,0; 5 10.16,0
1X06_NO_SILK = drill 1.016 pad 1.88: 1 0,0; 2 2.54,0; 3 5.08,0; 4 7.62,0; 5 10.16,0; 6 12.7,0
2X3-NS = drill 1.016 pad 1.88: 1 -2.54,-1.27; 2 -2.54,1.27; 3 0,-1.27; 4 0,1.27; 5 2.54,-1.27; 6 2.54,1.27
1X03 = drill 1.016 pad 1.88: 1 0,0; 2 2.54,0; 3 5.08,0
SMT-JUMPER_3_2-NC_PASTE_SILK = smd 0.635 x 1.27: 1 -0.813,0; 2 0,0; 3 0.813,0
CR54 = smd 5.5 x 2.15: P$1 0,1.92; P$2 0,-1.92
SML0603 = smd 0.8 x 0.8: A 0.75,0; C -0.75,0
SOT323 = smd 0.7 x 0.7: 1 -0.65,-0.925; 2 0.65,-0.925; 3 0,0.925
R0603 = smd 1 x 1.1: 1 -0.85,0; 2 0.85,0
SWITCH-SPST-SMD-A = smd 0.7 x 1.5: 1 -2.25,-1.75; 2 -0.75,-1.75; 3 2.25,-1.75 | smd 1 x 0.6: GND1 -3.65,1; GND3 3.65,1 | smd 1 x 0.8: GND2 -3.65,-1.1; GND4 3.65,-1.1 | hole 0.9: -1.5,0; 1.5,0
DW18 = smd 2.311 x 0.559: 1 -4.521,5.08; 2 -4.521,3.81; 3 -4.521,2.54; 4 -4.521,1.27; 5 -4.521,0; 6 -4.521,-1.27; 7 -4.521,-2.54; 8 -4.521,-3.81; 9 -4.521,-5.08; 10 4.521,-5.08; 11 4.521,-3.81; 12 4.521,-2.54; 13 4.521,-1.27; 14 4.521,0; 15 4.521,1.27; 16 4.521,2.54; 17 4.521,3.81; 18 4.521,5.08
KTT3_6P22X6P6 = smd 0.965 x 3.505: 1 -2.54,-9.677; 2 0,-9.677; 3 2.54,-9.677 | smd 10.719 x 10.363: 4 0,0
ESP12E-SMD = smd 3 x 1.2: ADC -8.3,3.8; CH_PD -8.3,1.8; GND 8.1,-8.2; GPIO0 8.1,-2.2; GPIO2 8.1,-4.2; GPIO4 8.1,-0.2; GPIO5 8.1,1.8; GPIO12 -8.3,-4.2; GPIO13 -8.3,-6.2; GPIO14 -8.3,-2.2; GPIO15 8.1,-6.2; GPIO16 -8.3,-0.2; RESET -8.3,5.8; RXD0 8.1,3.8; TXD0 8.1,5.8; VCC -8.3,-8.2 | smd 1.2 x 3: CS0 -4.8,-10.3; GPIO9 -0.8,-10.3; GPIO10 1.2,-10.3; MISO -2.8,-10.3; MOSI 3.2,-10.3; SCLK 5.2,-10.3
TQFP32-08 = smd 1.27 x 0.559: 1 -4.293,2.8; 2 -4.293,2; 3 -4.293,1.2; 4 -4.293,0.4; 5 -4.293,-0.4; 6 -4.293,-1.2; 7 -4.293,-2; 8 -4.293,-2.8; 17 4.293,-2.8; 18 4.293,-2; 19 4.293,-1.2; 20 4.293,-0.4; 21 4.293,0.4; 22 4.293,1.2; 23 4.293,2; 24 4.293,2.8 | smd 0.559 x 1.27: 9 -2.8,-4.293; 10 -2,-4.293; 11 -1.2,-4.293; 12 -0.4,-4.293; 13 0.4,-4.293; 14 1.2,-4.293; 15 2,-4.293; 16 2.8,-4.293; 25 2.8,4.293; 26 2,4.293; 27 1.2,4.293; 28 0.4,4.293; 29 -0.4,4.293; 30 -1.2,4.293; 31 -2,4.293; 32 -2.8,4.293
SWSIP3-P98 = drill 1.092 pad 1.651: 1 -4.978,0; 2 -2.489,0; 3 0,0
SWITCH_FSMSMTR = smd 2.108 x 1.6: 1 -9.271,0; 2 0,0
DRJ8_2P2X3 = smd 0.95 x 0.35: 1 -1.93,1.2; 2 -1.93,0.4; 3 -1.93,-0.4; 4 -1.93,-1.2; 5 1.93,-1.2; 6 1.93,-0.4; 7 1.93,0.4; 8 1.93,1.2 | smd 2.2 x 3: 9 0,0
DW24 = smd 2.311 x 0.559: 1 -4.521,6.985; 2 -4.521,5.715; 3 -4.521,4.445; 4 -4.521,3.175; 5 -4.521,1.905; 6 -4.521,0.635; 7 -4.521,-0.635; 8 -4.521,-1.905; 9 -4.521,-3.175; 10 -4.521,-4.445; 11 -4.521,-5.715; 12 -4.521,-6.985; 13 4.521,-6.985; 14 4.521,-5.715; 15 4.521,-4.445; 16 4.521,-3.175; 17 4.521,-1.905; 18 4.521,-0.635; 19 4.521,0.635; 20 4.521,1.905; 21 4.521,3.175; 22 4.521,4.445; 23 4.521,5.715; 24 4.521,6.985
TSOT-23_S5 = smd 1.219 x 0.508: 1 -1.143,0.95; 2 -1.143,0; 3 -1.143,-0.95; 4 1.143,-0.95; 5 1.143,0.95
FH12-16S-1SH = smd 0.3 x 1.3: 1 -7.5,3.25; 2 -6.5,3.25; 3 -5.5,3.25; 4 -4.5,3.25; 5 -3.5,3.25; 6 -2.5,3.25; 7 -1.5,3.25; 8 -0.5,3.25; 9 0.5,3.25; 10 1.5,3.25; 11 2.5,3.25; 12 3.5,3.25; 13 4.5,3.25; 14 5.5,3.25; 15 6.5,3.25; 16 7.5,3.25
X3-SMD-3.6X1.3X0.8MM = smd 0.7 x 1.7: 1 -1.2,0; 2 0,0; 3 1.2,0

### Placement (x,y rotation side)
20V!  51.44,33.02 90 top
C1  74.55,29.21 90 top
C2  70.23,25.4 90 top
C3  74.6,25.4 90 top
C4  70.28,29.21 90 top
C5  63.5,9.02 0 top
C8  16.51,69.01 0 top
C13  72.39,29.21 90 top
C14  68.58,17.6 180 top
C15  68.58,13.34 180 top
C16  68.58,15.49 180 top
C17  33.55,7.9 180 top
C18  68.58,11.18 0 top
C19  68.58,9.02 0 top
C20  43.74,5.97 270 top
C21  63.5,15.47 0 top
C22  63.5,13.34 0 top
C23  63.5,11.18 0 top
C24  52.22,14.81 0 top
C25  41.12,15.27 0 top
CR1  10.74,68.96 180 top
D1  25.4,36.2 0 top
D2  42.57,20.83 0 top
IC1  15.24,48.9 90 top
IC2  15.24,27.94 90 top
J1  74.3,34.29 90 top
J2  7.62,22.86 90 top
J3  1.59,43.81 90 top
J4  7.62,43.81 90 top
J5  1.59,22.86 90 top
J10  23.5,76.2 0 top
J11  20.32,6.35 90 top
J12  50.16,3.81 0 top
JP1  44.77,45.09 270 top
JP2  47.94,45.09 90 top
JP3  6.99,40.32 0 top
JP4  6.67,19.37 0 top
L1  46.48,27.05 0 top
LED1  76.2,43.81 0 top
LED2  76.2,41.76 0 top
LED3  76.2,11.43 0 top
LED4  76.2,13.34 0 top
LED5  45.72,67.94 180 top
LED6  19.05,13.97 90 top
LED7  12.78,35.92 0 top
LED8  12.78,38.01 0 top
LED9  12.78,39.93 0 top
LED10  12.78,41.91 0 top
LED11  11.77,15.48 0 top
LED12  11.77,17.22 0 top
LED13  11.71,19.1 0 top
LED14  11.7,20.85 0 top
Q1  31.11,36.2 90 top
Q2  35.56,36.2 90 top
R1  72.39,25.4 90 top
R2  16.98,36.03 180 top
R3  16.98,37.99 180 top
R4  16.98,39.92 180 top
R5  16.98,41.92 180 top
R6  15.63,15.41 180 top
R7  72.39,41.71 0 top
R8  15.66,17.28 180 top
R9  15.71,19.06 180 top
R10  15.63,20.84 180 top
R11  73.03,11.25 180 top
R12  73.03,13.34 0 top
R13  10.79,66.67 180 top
R14  34.62,41.91 90 top
R20  72.39,43.81 0 top
R21  45.72,69.85 180 top
R22  40.01,42.57 0 top
R23  30.25,41.91 90 top
R24  6.35,12.06 180 top
R25  20.95,13.97 270 top
R26  32.44,41.91 90 top
R27  40.01,40.39 0 top
R28  28.09,41.91 90 top
R29  25.91,41.91 90 top
R30  22.23,66.04 180 top
R31  16.51,66.67 180 top
R32  23.7,41.91 90 top
R33  51.64,18.59 270 top
R34  52.25,12.93 180 top
R35  53.95,18.59 270 top
R36  52.3,10.72 0 top
S3  15.88,75.56 0 top
U1  59.69,71.12 90 top
U2  59.69,45.72 270 top
U3  60.33,31.75 0 top
U6  34.29,58.42 0 top
U7  32.38,22.23 0 top
U8  63.5,3.81 180 top
U9  40.01,76.2 180 top
U10  12.06,2.54 270 top
U11  46.56,15.29 0 top
U$1  57.78,58.42 270 top
U$2  [LOGO-L]  78.74,60.96 270 bottom
U$3  73.66,20.32 270 top
U$4  [SRM-LOGO-M]  20.32,72.39 270 bottom
X1  77.47,58.42 90 top
Y1  24.13,19.68 270 top

### Tracks (layer width: path | path; a pad name or v marks a point on that pad's centre or on a via)
+3V3  (via drill 0.35)
  Top 0.305: 33.3,34.29 Q1.1 | 33.3,34.29 35.56,34.29 36.48,35.22 Q2.1 38.72,35.55 | 33.3,34.29 29.21,34.29 28.57,34.92 28.57,36.2 27.88,36.9 D1.A 26.9,37.47 v27.96,38.53 | 38.72,35.55 40.85,37.68 R27.2 R22.2 | C15.1 C16.1 C14.1 | 74.12,17.6 C14.1 | 74.12,17.6 74.61,18.09 U$3.5 75.06,19.18 76.2,20.32 76.2,22.23 74.6,23.82 C3.1 | LED4.A 76.95,14.77 74.12,17.6 | v16.83,63.82 15.66,64.98 R31.2 13.76,64.77 10.79,64.77 9.95,65.62 R13.2 | S3.3 18.91,73.03 23.5,73.03 | J10.3 28.57,74.3 27.3,73.03 23.5,73.03 | v20.95,67.94 20.95,70.48 23.5,73.03 | v26.7,48.26 25.99,48.97 U6.VCC 23.97,50.22 23.09,51.1 23.09,60.73 21.59,62.23 20.95,62.23 20.32,62.87 20.32,64.77 19.68,65.41 | C14.1 69.43,23.05 v66.8,25.68 | v41.4,29.18 41.4,32.86 38.72,35.55 | v18.41,65.41 19.68,65.41 | 19.68,65.41 20.32,66.04 R30.2
  Bottom 0.305: v16.83,63.82 v18.41,65.41 v20.95,67.94 | v27.96,38.53 30.25,40.82 30.25,44.96 26.95,48.26 v26.7,48.26 | v66.8,25.68 55.58,25.68 53.37,27.89 42.7,27.89 v41.4,29.18
+5V  (via drill 0.35)
  Top 0.305: LED3.A 76.95,9.64 75.56,8.26 72.39,8.26 71.12,6.99 68.58,6.99 67.73,7.83 C19.1 C18.1 66.29,11.18 v66.04,11.43 | R24.2 5.5,9.74 v6.35,8.89 | C13.1 C4.1 | C13.1 C1.1 75.75,28.36 v76.5,27.61 | R1.2 C13.1 | U7.4 25.68,22.62 | U7.6 27.28,21.02 25.68,22.62 | R26.2 R23.2 29.11,43.9 v29.11,44.6 | 25.68,22.62 v25.45,22.62 | v74.62,22.83 74.62,21.48 U$3.1 | U$1.24 64.77,52.65 v65.68,51.74
  Top 0.406: IC1.9 17.45,58.62 v17.45,61.65 | R24.2 v5.5,15.21 5.5,19.01 JP4.1 | JP3.1 6.17,38.38 IC2.9 14.63,32.38 v15.21,31.8
  Top 0.508: U7.18 38.64,20.23 39.37,20.95 39.37,26.04 v40.01,26.67
  Top 1.016: U3.3 64.92,22.07 v66.04,20.95
  Bottom 0.305: v6.35,8.89 10.16,8.89 15.24,3.81 J11.2 | v66.04,11.43 v66.04,20.95 72.69,27.61 | v17.45,61.65 17.45,54.94 v20.95,51.44 | v25.45,22.62 25.45,26.62 | v29.11,44.6 28.32,45.39 v21.59,45.39 | 21.58,38.42 21.59,38.41 21.59,34.92 | v74.62,22.83 76.5,24.71 v76.5,27.61 72.69,27.61 | v65.68,51.74 65.68,34.62 72.69,27.61
  Bottom 0.406: v15.21,31.8 18.47,31.8 20.54,33.87 | 20.54,33.87 21.59,34.92 | 20.54,33.87 20.54,21.93 13.82,15.21 v5.5,15.21 | 25.45,26.62 25.45,30.53 v26.04,31.11 | v24.36,32.61 24.74,32.23
  Bottom 1.016: v20.95,51.44 21.59,50.16 v21.59,45.39 21.59,34.92 24.74,32.23 v26.04,31.11 37.47,31.11 40.01,28.57 v40.01,26.67 52.07,26.67 54.61,24.13 64.77,24.13 66.04,22.86 v66.04,20.95
+24V  (via drill 0.35)
  Top 0.305: U1.10 64.77,73.66 72.51,65.92 X1.16 75.33,65.92 77.55,63.7 77.55,54.05 75.56,52.07 | J1.2 75.56,36.83 78.11,39.37 78.11,42.66 LED1.A 76.95,46.24 75.56,47.62 75.56,52.07 | 75.56,52.07 74.72,52.92 X1.3 | U2.10 54.61,38.66 55.8,37.47 69.29,37.47 v71.07,35.69
  Top 0.508: U2.10 51.44,38.02 20V!.2
  Bottom 0.305: v71.07,35.69 73.15,35.69 J1.2
A0  (via drill 0.35)
  Top 0.305: U$1.10 53.34,60.91 v55.4,58.85 | v40.49,29.95 38.53,27.99 38.53,24.74 38.02,24.23 U7.23
  Bottom 0.305: v55.4,58.85 55.4,44.86 v40.49,29.95
A1  (via drill 0.35)
  Top 0.305: U7.24 36.68,27.25 v40.64,31.22 | v52.09,60.45 52.07,60.48 U$1.11
  Bottom 0.305: v40.64,31.22 52.09,42.67 v52.09,60.45
A2  (via drill 0.35)
  Top 0.305: U$1.14 52.07,52.27 v51.33,51.54 | v39.57,31.5 37.69,31.5 35.23,29.03 35.23,26.56 U7.25
  Bottom 0.305: v51.33,51.54 51.33,43.26 v39.57,31.5
A3  (via drill 0.35)
  Top 0.305: U7.26 34.38,30.02 37.41,33.05 v39.57,33.05 | v49.84,51.46 50.8,52.43 U$1.13
  Bottom 0.305: v39.57,33.05 49.84,43.31 v49.84,51.46
DTR  (via drill 0.35)
  Top 0.305: CR1.1 v13.34,68.96 15.61,68.96 C8.1
  Bottom 0.305: J10.6 36.2,74.93 34.29,73.03 22.23,73.03 19.68,70.48 14.86,70.48 v13.34,68.96
ESPRST  (via drill 0.35)
  Top 0.305: C8.2 R31.1 18.1,66.67 18.41,66.99 21.27,66.99 21.59,67.31 24.77,67.31 25.4,66.67 25.4,64.81 U6.RESET 29.12,64.22 v29.21,64.14 | v40.01,73.03 U9.2
  Bottom 0.305: v29.21,64.14 31.11,64.14 v40.01,73.03
ESPRX  (via drill 0.35)
  Top 0.305: J10.4 31.11,69.22 38.1,62.23 v39.6,62.23 U6.RXD0 | JP1.2 43.23,45.09 v42.72,44.58
  Bottom 0.305: v42.72,44.58 42.72,59.11 v39.6,62.23
ESPTX  (via drill 0.35)
  Top 0.305: U6.TXD0 v42.39,67.47 J10.5 | JP2.2 49.2,45.09 50.19,46.08 50.19,47.75 49.33,48.62 46.53,48.62 v45.8,49.35
  Bottom 0.305: v45.8,49.35 45.8,64.06 v42.39,67.47
GND  (via drill 0.35)
  Top 0.254: v68.58,76.2 v68.58,74.93 v69.85,74.93 69.85,76.02 | 69.85,76.02 v69.85,76.2 | v68.58,76.2 69.67,76.2 69.85,76.02 | U9.1 51.36,76.2 52.81,77.65 67.13,77.65 v68.58,76.2 | v56.52,6.99 v55.24,6.99 v53.98,6.99 v52.7,6.99 52.7,6.35 J12.1
  Top 0.305: C24.1 51.35,14.68 R34.1 55.02,12.93 v55.88,12.06 | C25.1 40.25,15.48 41.27,16.51 v42.55,16.51 43.36,15.69 U11.2 45.9,15.69 46.43,15.16 | R11.1 73.88,11.63 R12.1 70.02,11.18 C18.2 | C21.2 C22.2 C23.2 C5.2 | C16.2 C15.2 69.43,11.63 C18.2 | C16.2 64.38,15.49 C21.2 | C14.2 C16.2 | C19.2 C18.2 | C21.2 64.35,17.57 63.5,18.41 v61.59,18.41 60.33,19.68 U3.2 U3.4 62.87,34.29 J1.1 | U11.4 45.36,14.09 46.43,15.16 | 46.43,15.16 U11.9 | v46.99,12.06 46.43,12.62 46.43,15.16 | Y1.2 22.23,19.68 20.95,18.41 20.95,14.83 | 20.95,14.83 R25.1 | 12.06,12.7 U10.1 14.99,8.89 J11.6 19.05,10.34 20.27,11.56 21.79,11.56 22.91,12.68 22.91,14.15 22.23,14.83 20.95,14.83 | U9.1 46.57,73.49 R21.1 50.8,65.62 | 50.8,65.62 U$1.12 50.8,59.82 53.37,57.25 53.37,53.92 U$1.15 53.34,52.7 54.61,51.44 U2.9 42.41,50.24 U6.GND 42.44,50.17 42.44,47.22 42.11,46.89 40.97,46.89 37.13,43.05 v37.13,41.99 36.21,41.06 R14.1 | S3.1 v12.2,72.39 10.16,72.39 7.62,69.85 v7.62,64.14 | C1.2 C13.2 C4.2 69.43,30.06 68.58,29.21 68.58,27.3 69.64,26.25 C2.2 | J1.1 74.55,34.04 C1.2 | C3.2 76.42,26.25 77.47,27.3 v77.47,29.21 76.62,30.06 C1.2 | R20.1 R7.1 71.54,37.05 J1.1 | U1.9 64.77,67.94 63.5,69.22 54.4,69.22 50.8,65.62 | 25.81,33.93 v25.81,33.98 | v34.19,22.62 U7.21 | U$3.2 v73.66,20.27
  Top 0.406: U10.1 7.48,16.4 JP4.3 | JP3.3 7.9,40.22 7.9,37.97 11.94,33.93 v17.27,33.93 18.31,32.89 IC2.8 18.34,32.41 20.57,32.41 21.36,31.62 21.36,28.42 v22.59,27.19 26.36,23.43 U7.3 29.33,23.43 30.26,22.49 | IC1.8 17.37,53.34 v15.8,54.91 | v25.81,33.98 22.66,33.98 v20.37,36.27 | 30.26,22.49 30.33,22.43 33.99,22.43 v34.19,22.62 | U7.5 29.6,21.82 30.26,22.49 | Y1.2 25.63,19.68 v25.88,19.43
  Top 1.016: J12.1 44.08,3.81 | 44.08,3.81 C20.- | C17.- 39.99,7.9 44.08,3.81
  Bottom 0.254: v15.8,54.91 15.8,47.24 16.54,46.51 16.54,34.67 v17.27,33.93
  Bottom 0.305: v61.59,18.41 55.88,12.7 v55.88,12.06 v46.99,12.06 50.16,8.89 J12.1 | v12.2,72.39 18.41,72.39 22.23,76.2 J10.1 | v25.81,33.98 25.81,35.1 30.23,39.52 34.67,39.52 v37.13,41.99 | v73.66,20.27 75.08,20.27 77.78,22.96 77.78,28.91 v77.47,29.21
  Bottom 0.406: v15.8,54.91 15.8,55.96 v7.62,64.14 | v34.19,22.62 34.19,19.76 36.09,17.86 39.32,17.86 40.66,16.51 v42.55,16.51 | v17.27,33.93 18.03,33.93 v20.37,36.27 | v25.88,19.43 25.88,21.16 24.72,22.32 24.72,22.35 23.04,24.03 23.04,26.75 v22.59,27.19
  pour Top (isolate 0.254): 0,80.01 80.01,80.01 80.01,0 0,0
  pour Bottom (isolate 0.406): 0,80.01 80.01,80.01 80.01,0 0,0
GPIO0  (via drill 0.35)
  Top 0.305: R13.1 9.63,68.69 CR1.2 11.79,71.12 13.97,71.12 | 13.97,71.12 15.12,72.28 S3.2 | U6.GPIO0 39.66,56.22 26.67,69.22 v24.13,69.22 | v19.68,69.22 19.68,69.85 18.41,71.12 13.97,71.12
  Bottom 0.305: v24.13,69.22 v19.68,69.22
IN11  (via drill 0.35)
  Top 0.406: U7.32 29.62,26.55 v29.62,33.15 | v29.16,37.08 29.21,37.13 v29.21,41.88 | v23.01,44.4 22.96,44.45 IC1.1
  Bottom 0.406: v29.62,33.15 29.16,33.6 v29.16,37.08 | v29.21,41.88 26.7,44.4 v23.01,44.4
IN12
  Top 0.406: IC1.2 16.82,45.72 16.23,45.14 16.23,44.4 17.22,43.41 18.36,43.41 19.15,42.62 19.15,36.22 19.96,35.41 19.96,35.38 24.43,30.91 24.43,29.29 28.09,25.63 U7.1
IN13  (via drill 0.35)
  Top 0.406: U7.2 27.06,24.23 22.84,28.45 22.84,31.14 19.61,34.37 18.14,34.37 v17.63,34.87 | v20.3,46.28 19.58,46.99 IC1.3
  Bottom 0.406: v17.63,34.87 17.63,43.61 v20.3,46.28
IN14  (via drill 0.35)
  Top 0.406: IC1.4 21.36,48.26 v22.84,46.79 | v24.87,46.25 24.87,39.5 v24,38.63 | v27.74,32.56 v27.74,29.64 | U7.9 28.32,17.93 v27.76,17.37
  Bottom 0.406: v22.84,46.79 24.33,46.79 v24.87,46.25 | v24,38.63 24,34.54 25.93,32.61 27.69,32.61 v27.74,32.56 | v27.76,17.37 27.76,29.62 v27.74,29.64
IN21  (via drill 0.35)
  Top 0.406: U7.11 31.18,16.55 30.33,15.7 23.82,15.7 v22.35,17.17 | v20.8,20.07 20.8,22.84 20.14,23.5 IC2.1
  Bottom 0.406: v22.35,17.17 22.35,18.52 v20.8,20.07
IN22  (via drill 0.35)
  Top 0.406: IC2.2 19.96,24.77 21.87,22.86 v21.87,21.13 | U7.12 31.98,16.19 30.5,14.71 v23.85,14.71
  Bottom 0.406: v21.87,21.13 23.85,19.15 v23.85,14.71
IN23  (via drill 0.35)
  Top 0.406: IC2.3 19.91,26.04 v23.19,22.76 | v24.92,13.39 30.3,13.39 32.79,15.88 U7.13
  Bottom 0.406: v23.19,22.76 24.92,21.03 v24.92,13.39
IN24  (via drill 0.35)
  Top 0.406: U7.14 33.59,15.25 30.58,12.24 25.81,12.24 v24.92,11.35 | v18.49,18.01 19.96,19.48 19.96,21.95 19.38,22.53 16.69,22.53 15.29,23.93 15.29,25.88 16.71,27.3 IC2.4
  Bottom 0.406: v24.92,11.35 22.5,11.35 18.41,15.44 18.41,17.93 v18.49,18.01
IO12  (via drill 0.35)
  Top 0.305: R29.2 25.91,47.35 v25.15,48.11 | v29.46,54.2 26.01,54.2 U6.GPIO12
  Bottom 0.305: v25.15,48.11 25.15,49.89 v29.46,54.2
IO13
  Top 0.305: R28.2 28.09,51.38 27.15,52.32 26.09,52.32 U6.GPIO13
IO16  (via drill 0.35)
  Top 0.305: R32.2 23.7,48.59 v23.67,48.62 | v28.63,58.24 26.01,58.24 U6.GPIO16
  Bottom 0.305: v23.67,48.62 23.67,53.29 v28.63,58.24
MEGARX  (via drill 0.35)
  Top 0.305: Q2.3 33.66,37.17 v33.66,37.36 33.66,38.73 32.44,39.95 R26.1 | U7.30 31.18,31.11 v33.3,33.22
  Bottom 0.305: v33.3,33.22 33.3,37.01 v33.66,37.36
MEGARXLV  (via drill 0.35)
  Top 0.305: JP2.1 JP1.3 44.77,40.55 v42.72,38.51 | R27.1 v39.16,38.66 39.16,38.52 37.47,36.83 36.5,36.83 Q2.2
  Bottom 0.305: v42.72,38.51 39.31,38.51 v39.16,38.66
MEGATX  (via drill 0.35)
  Top 0.305: Q1.3 30.25,36.26 v30.25,38.25 R23.1 | U7.31 30.39,32.37 v31.32,33.3
  Bottom 0.305: v31.32,33.3 31.32,37.19 v30.25,38.25
MEGATXLV  (via drill 0.35)
  Top 0.305: JP2.3 JP1.1 40.82,45.9 39.16,44.23 39.16,42.65 | 39.16,42.65 R22.1 | Q1.2 32.04,37.96 v32.41,38.33 | v37.62,40.66 37.62,41.11 39.16,42.65
  Bottom 0.305: v32.41,38.33 35.28,38.33 v37.62,40.66
MISO  (via drill 0.35)
  Top 0.305: v35.23,11.4 35.23,17.89 U7.16
  Bottom 0.305: J11.1 27.64,3.81 v35.23,11.4
MOSI
  Top 0.406: U7.15 34.38,13.1 31.98,10.69 27.64,10.69 25.4,8.46 25.4,3.94 23.34,1.88 17.78,1.88 16.24,3.42 | 16.24,3.42 16.2,3.45 | 16.24,3.42 16.24,5.07 17.5,6.33 19.02,6.33 J11.4
N$1
  Top 1.016: J12.3 59.69,3.81 61.9,1.6 65.1,1.6 66.04,2.54 66.04,3.76 U8.2
N$2
  Top 0.406: LED7.A 13.64,36.03 R2.2
N$3
  Top 0.305: U$1.2 U1.8
N$4
  Top 0.305: U$1.3 U1.7
N$5
  Top 0.305: U$1.4 U1.6
N$6
  Top 0.305: U$1.5 U1.5
N$7
  Top 0.305: U$1.6 U1.4
N$8
  Top 0.305: U$1.7 U1.3
N$9
  Top 0.305: U$1.8 U1.2
N$10
  Top 0.305: U$1.9 U1.1
N$11
  Top 0.305: U2.1 64.77,51.44 63.5,52.7 U$1.23
N$12
  Top 0.305: U2.2 63.5,51.44 62.23,52.7 U$1.22
N$13
  Top 0.305: U2.3 62.23,51.44 60.96,52.7 U$1.21
N$14
  Top 0.305: U2.4 60.96,51.44 59.69,52.7 U$1.20
N$15
  Top 0.305: U2.5 59.69,51.44 58.42,52.7 U$1.19
N$16
  Top 0.305: U2.6 58.42,51.44 57.15,52.7 U$1.18
N$17
  Top 0.406: LED8.A 13.55,37.99 R3.2
N$18
  Top 0.254: LED7.C 9.45,38.49 9.45,44.53
  Top 0.406: IC1.16 9.53,44.45 9.45,44.53 J4.2 J3.2
N$19  (via drill 0.35)
  Top 0.254: LED8.C 11.39,38.01 v10.52,38.89
  Top 0.406: IC1.15 10.79,45.72 J4.3 J3.3
  Bottom 0.254: v10.52,38.89 6.63,38.89 3.61,41.91 3.61,46.88 J3.3
N$20  (via drill 0.35)
  Top 0.254: LED9.C 11.02,39.93 v10.52,40.44
  Top 0.406: IC1.14 10.79,46.99 9.21,48.58 9.21,49.85 J4.4
  Bottom 0.254: v10.52,40.44 7.98,40.44 5.11,43.31 5.11,48.92 J4.4
  Bottom 0.406: J3.5 4.13,51.44 J4.4
N$21
  Top 0.305: X1.15 72.24,64.92 63.5,73.66 U1.11
N$22
  Top 0.305: X1.14 71.97,63.92 62.23,73.66 U1.12
N$23
  Top 0.305: X1.13 71.7,62.92 60.96,73.66 U1.13
N$24  (via drill 0.35)
  Top 0.305: X1.6 75.33,55.92 v76,56.59 | v59.77,72.97 59.77,75.56 U1.14
  Bottom 0.305: v76,56.59 76,56.74 v59.77,72.97
N$25  (via drill 0.35)
  Top 0.305: U1.15 58.42,72.62 v59.77,71.27 | v76,55.12 75.8,54.92 X1.5
  Bottom 0.305: v59.77,71.27 59.99,71.27 76.15,55.12 v76,55.12
N$26  (via drill 0.35)
  Top 0.305: X1.4 73.49,53.92 v72.49,54.91 | v57.58,71.91 57.15,72.34 U1.16
  Bottom 0.305: v72.49,54.91 72.49,57 v57.58,71.91
N$27  (via drill 0.35)
  Top 0.305: U1.17 55.88,71.78 v56.31,71.35 | v70.79,56.95 74.19,56.95 X1.7
  Bottom 0.305: v56.31,71.35 56.39,71.35 v70.79,56.95
N$28  (via drill 0.35)
  Top 0.305: X1.8 70.8,57.92 v69.67,56.79 | v54.69,71.5 54.69,75.56 U1.18
  Bottom 0.305: v69.67,56.79 69.39,56.79 v54.69,71.5
N$29
  Top 0.305: U2.8 55.88,51.44 54.61,52.7 U$1.16
N$30
  Top 0.305: U2.18 64.77,46.35 66.67,48.26 66.67,59.05 69.54,61.92 X1.12
N$31
  Top 0.305: U2.17 63.5,40.01 64.14,39.37 66.67,39.37 67.31,40.01 67.31,58.42 69.85,60.96 74.18,60.96 X1.11
N$32
  Top 0.305: U2.16 62.23,40.01 63.5,38.73 67.31,38.73 67.94,39.37 67.94,57.78 70.08,59.92 X1.10
N$33
  Top 0.305: U2.15 60.96,40.01 62.87,38.1 67.94,38.1 68.58,38.73 68.58,57.15 70.35,58.92 X1.9
N$34
  Top 0.305: U2.7 57.15,51.44 55.88,52.7 U$1.17
N$35  (via drill 0.35)
  Top 0.254: LED10.C 12.01,41.91 v10.69,43.23
  Top 0.406: IC1.13 10.79,48.26 10.16,48.9 10.16,52.7 8.89,53.98 J4.5 5.08,51.44 J3.4
  Bottom 0.254: v10.69,43.23 10.69,50.9 J4.5
N$37
  Top 0.305: U11.7 49.35,15.69 49.53,15.88 49.53,17.14 50.16,17.78 51.6,17.78 R33.2
  Top 0.508: R33.2 52.25,17.74 R35.1 53.98,19.47 53.98,20.32 52.7,21.59 52.7,27.3 51.44,28.57 46.88,28.57 L1.P$1
N$38
  Top 0.305: U$3.4 72.26,19.18 70.23,21.21 C2.1
N$39
  Top 0.305: U$3.3 72.71,23.18 72.39,23.5 R1.1
N$43
  Top 0.254: 9.53,23.5 9.53,21.77 8.71,20.95 8.71,16.51 9.78,15.44 10.98,15.44 LED11.C
  Top 0.406: J5.2 J2.2 9.53,23.5 IC2.16
N$44  (via drill 0.35)
  Top 0.254: LED12.C 9.91,17.22 v9.78,17.35
  Top 0.406: J5.3 J2.3 10.79,24.77 IC2.15
  Bottom 0.254: v9.78,17.35 5,17.35 3.45,18.9 3.45,26.07 J5.3
N$45
  Top 0.305: R7.2 75.4,41.71 LED2.C
N$46  (via drill 0.35)
  Top 0.254: LED13.C 9.68,19.1 v9.63,19.15
  Top 0.406: IC2.14 11.11,26.04 9.53,27.62 9.53,28.57 J2.4
  Bottom 0.254: v9.63,19.15 6.4,19.15 4.93,20.62 4.93,29.68 4.13,30.48
  Bottom 0.406: J2.4 4.13,30.48 J5.5
N$47  (via drill 0.35)
  Top 0.254: LED14.C 10.95,22.02 v10.69,22.28
  Top 0.406: J5.4 5.08,30.48 J2.5 10.48,30.16 10.48,27.94 11.11,27.3 IC2.13
  Bottom 0.254: v10.69,22.28 10.69,29.95 J2.5
N$48
  Top 0.406: LED11.A 12.6,15.4 R6.2
N$49
  Top 0.406: LED12.A 12.59,17.29 R8.2
N$50
  Top 0.305: R11.2 72.17,9.79 72.69,9.27 74.98,9.27 75.49,9.78 75.49,11.39 LED3.C
N$51
  Top 0.305: R12.2 LED4.C
N$52
  Top 0.305: R30.1 23.07,62.02 24.87,60.22 U6.CH_PD
N$53
  Top 0.406: LED13.A 12.5,19.06 R9.2
N$54
  Top 0.406: LED14.A R10.2
N$55
  Top 0.305: R25.2 19.15,13.12 LED6.C
N$56
  Top 0.305: LED5.C 46.47,68.25 R21.2
N$57
  Top 0.406: LED9.A 13.54,39.92 R4.2
N$58
  Top 0.305: Y1.3 27.15,18.48 U7.8
N$59
  Top 0.305: U7.7 26.51,20.23 25.86,20.88 Y1.1
N$60
  Top 0.305: D1.R 25.77,35.49 25.25,36.02 25.25,37.24 28.07,40.06 28.07,41.03 R28.1
N$61
  Top 0.305: D1.B 25.91,38.9 R29.1
N$62
  Top 0.305: D1.G 23.84,35.56 22.86,35.56 22.23,36.2 22.23,38.1 23.7,39.57 R32.1
N$63  (via drill 3.81 pad 5.08)
  other vias: 5.08,5.08
N$64  (via drill 3.81 pad 5.08)
  other vias: 74.93,5.08
N$65
  Top 0.406: LED10.A 13.54,41.92 R5.2
N$66  (via drill 0.35)
  Top 0.254: R10.1 17.95,20.84 v18.57,21.46
  Top 0.406: J5.1 J2.1 6.67,21.91 JP4.2 | R6.1 16.51,15.43 R8.1 16.56,17.34 R9.1 16.48,19.14 R10.1
  Bottom 0.254: J2.1 7.62,22.53 9.45,20.7 17.8,20.7 v18.57,21.46
N$68  (via drill 0.35)
  Top 0.254: v14.71,43.31 16.45,43.31 R5.1
  Top 0.406: J3.1 J4.1 6.99,43.18 JP3.2 | R2.1 R3.1 R4.1 R5.1
  Bottom 0.254: J4.1 9.86,41.58 12.65,41.58 14.38,43.31 v14.71,43.31
N$69  (via drill 3.81 pad 5.08)
  other vias: 74.93,74.93
N$70  (via drill 3.81 pad 5.08)
  other vias: 5.08,74.93
N$71
  Top 0.508: 38.73,13.34 38.73,16.51 40.64,18.41 40.64,20.8 D2.C 40.67,22.25 42.55,24.13 42.55,31.11 43.18,31.75 50.57,31.75 20V!.1 | C17.+ 33.3,7.9 38.73,13.34 | R36.1 41.35,10.72 38.73,13.34
N$72
  Top 0.305: U11.5 50.24,14.09 R34.2 51.4,12.47 R36.2
N$79
  Top 0.305: LED1.C R20.2
N$80
  Top 0.305: LED5.A 45.09,67.83 45.09,59.69 43.62,58.22 U6.GPIO4
N$84  (via drill 0.35)
  Top 0.305: U6.GPIO15 37.84,52.22 v37.21,51.59 | v34.59,44.58 34.59,42.78 R14.2
  Bottom 0.305: v37.21,51.59 37.21,47.19 v34.59,44.58
N$85
  Top 0.305: U11.8 48.49,18.01 49.53,19.05 51.24,19.05 R33.1
N$86
  Top 0.508: 44.63,20.67 D2.A | U11.1 44.63,20.67 | L1.P$2 46.48,22.52 44.63,20.67
N$88
  Top 0.305: U11.3 43.53,14.89 43.19,15.23 42.03,15.23 C25.2
PULSE  (via drill 0.35)
  Top 0.305: LED2.A 76.95,40.53 v76.53,40.11 | U$1.1 v64.77,59.84 | v69.04,33.45 67.28,31.7 v67.28,30.66 | v46.33,33.6 44.22,35.71 v40.72,35.71 | v35.36,32.61 32.84,30.1 v32.84,28.6 | v33.25,20.32 31.17,20.32 30.38,19.53 U7.10
  Bottom 0.305: v64.77,59.84 76.53,48.08 v76.53,40.11 75.44,39.01 70.94,39.01 69.04,37.11 v69.04,33.45 | v67.28,30.66 64.34,33.6 v46.33,33.6 | v40.72,35.71 37.62,32.61 v35.36,32.61 | v32.84,28.6 33.25,28.19 v33.25,20.32
RST  (via drill 0.35)
  Top 0.305: R24.1 7.2,9.95 8.89,8.26 8.89,3.17 9.53,2.54 U10.2 12.06,4.24 v15.06,7.24 | U7.29 31.98,23.67 v32,23.65
  Bottom 0.305: v32,23.65 32,13.26 27.64,8.89 21.64,8.89 | 21.64,8.89 J11.5 | v15.06,7.24 15.06,9.35 16.71,11 20.85,11 21.57,10.29 21.57,8.97 21.64,8.89
SCK  (via drill 0.35)
  Top 0.305: v37.69,16.71 36.68,17.73 U7.17
  Bottom 0.305: J11.3 27.33,6.35 v37.69,16.71
SDA  (via drill 0.35)
  Top 0.406: LED6.A 19.05,15.47 v19.68,16.1 | v30.89,21.29 30.99,21.18 v35.08,21.18 | v35.13,23.75 33.59,25.29 U7.27
  Bottom 0.406: v19.68,16.1 23.42,12.37 26.47,12.37 30.89,16.79 v30.89,21.29 | v35.08,21.18 35.13,21.23 v35.13,23.75
VCC
  Top 0.305: U11.6 49.82,14.89 51.44,16.51 52.07,16.51 | 53.02,16.19 53.34,15.88 | 53.02,16.19 52.7,16.51 | 53.34,15.68 53.34,15.88 | 53.34,15.68 53.34,15.24 | 53.34,15.24 53.34,15.05 C24.2 53.1,15.42 | 52.07,16.51 52.7,16.51 | 52.42,16.16 52.07,16.51 | 52.61,15.97 52.42,16.16 | 52.61,15.97 52.7,15.88 52.7,15.83 | 52.7,15.29 52.7,15.83 | 52.7,15.29 52.7,15.24 | 52.7,16.51 52.7,16.44 52.42,16.16 | 53.02,16.19 52.83,16.19 52.61,15.97 | 53.02,16.19 53.02,16.15 52.7,15.83 | 52.7,15.83 53.07,15.83 53.19,15.83 53.34,15.68 | 53.34,15.88 53.3,15.88 52.97,15.55 | 52.97,15.55 52.7,15.29 | 53.1,15.42 52.97,15.55 | 53.34,15.24 53.28,15.24 53.1,15.42
  Top 0.508: R35.2 53.95,16.71 53.07,15.83
  Top 1.016: U3.1 57.78,14.68 | C5.1 62.42,8.79 | C24.2 57.66,14.81 57.78,14.68 | C5.1 62.65,7.2 63.5,6.35 66.67,6.35 68.58,4.45 68.58,3.91 U8.1 | C5.1 C23.1 C22.1 C21.1 | 57.78,14.68 57.78,10.16 56.52,8.89 | 56.52,8.89 44.16,8.89 C20.+ | 56.52,8.89 62.52,8.89 C5.1

### Text on the board
tPlace: MTX | ETX | ERX | MRX
bPlace: Sprinter - Controller V4.0 | #karpeDiem